# Altium project UE_Frequency_Converter.PrjPcb (part 1 of 2)
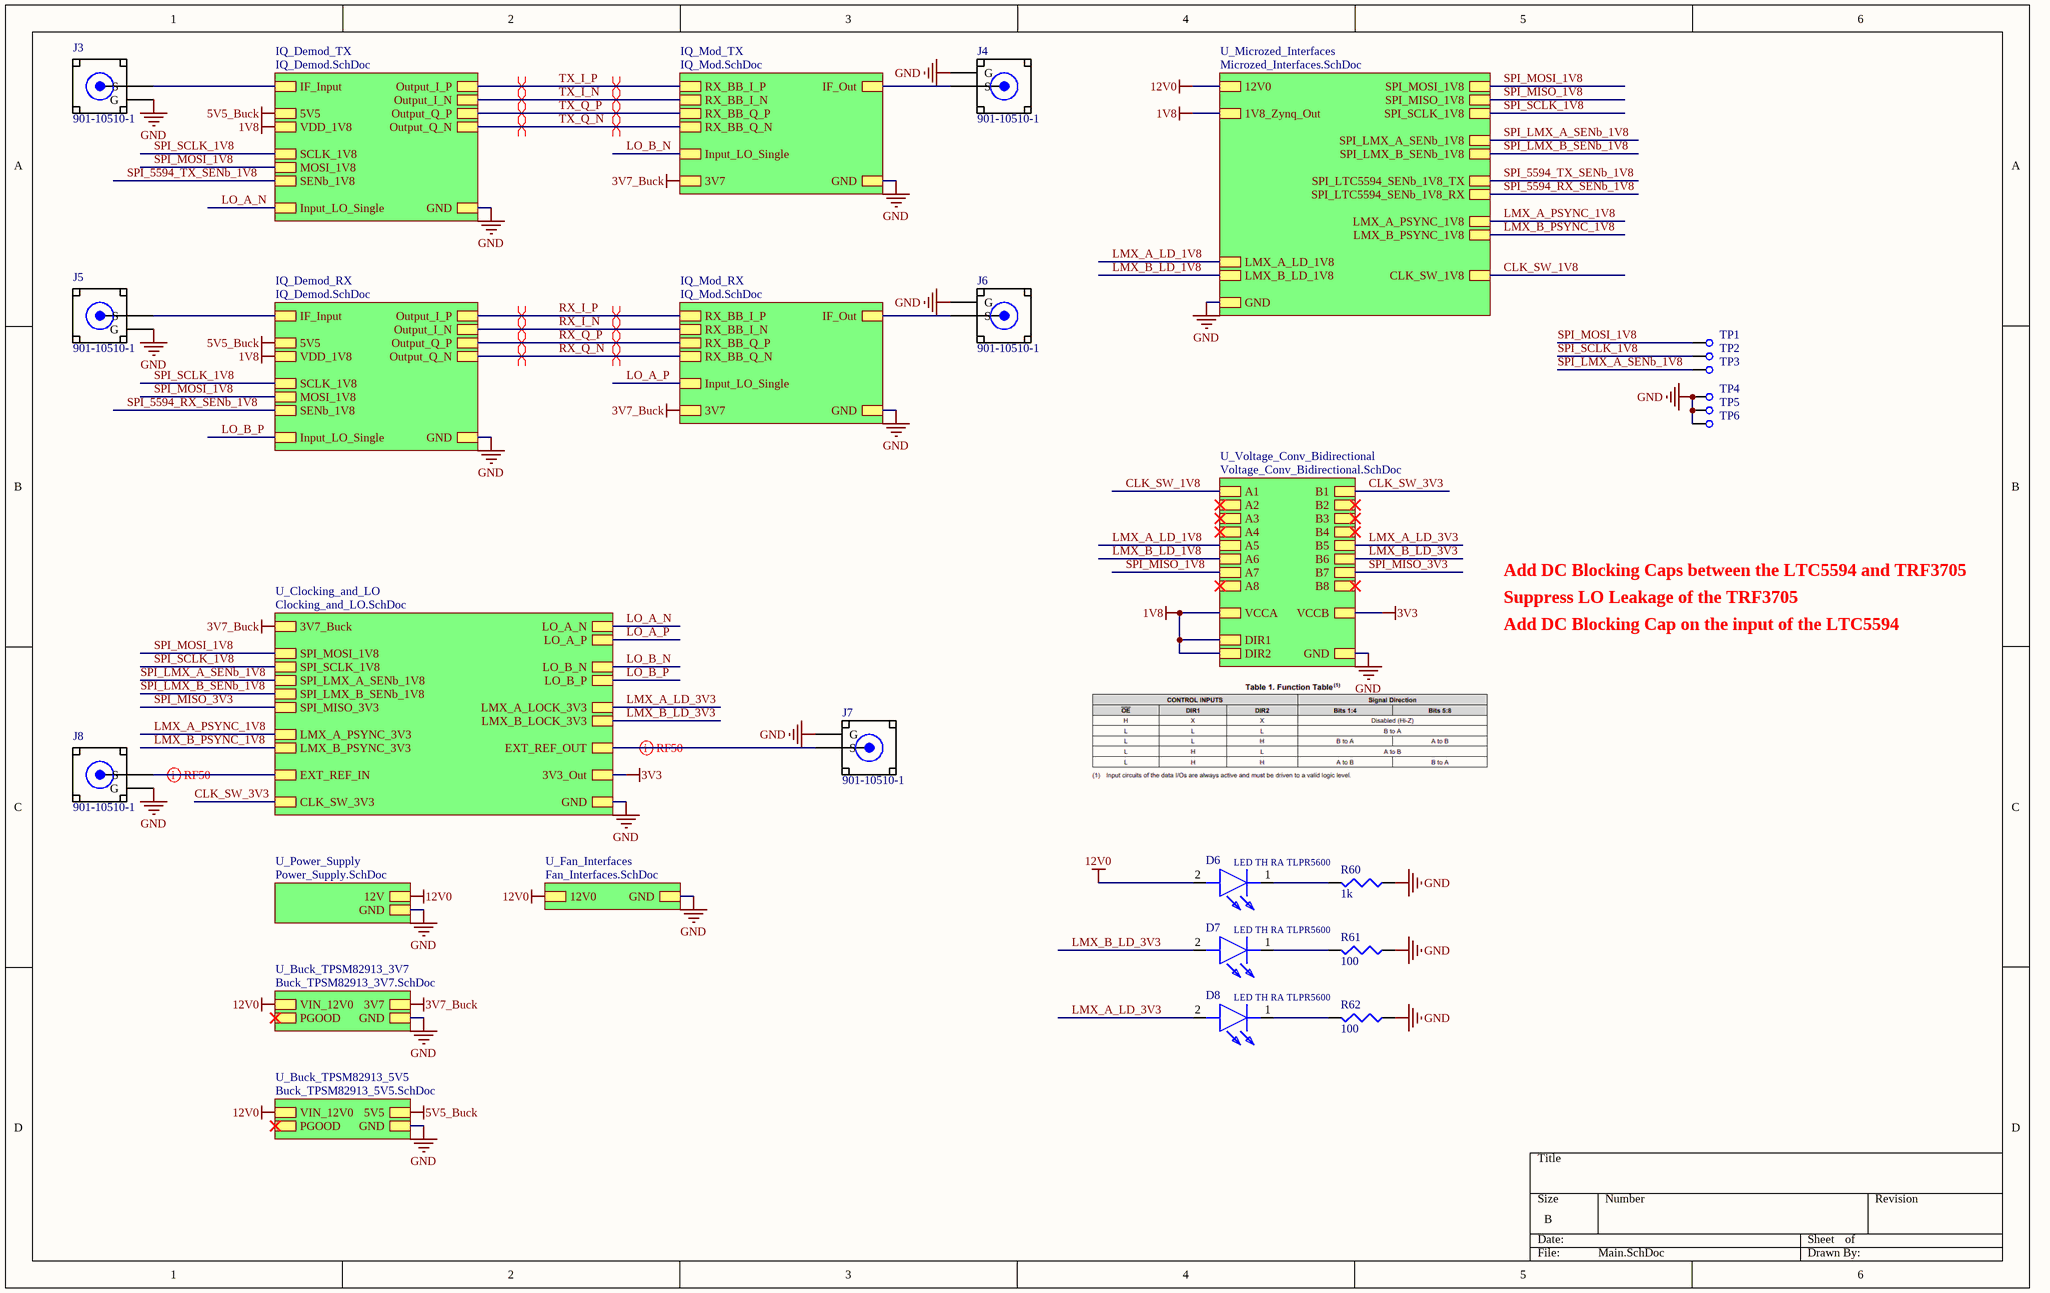
[diagram p0: Main.SchDoc]
15 sheets, 424 parts. Net scope: strictly hierarchical (ports join the sheet entries above them; power ports are local).
Board file: Main.PcbDoc
Sheets:
  Main.SchDoc
    IQ_Mod_TX = IQ_Mod.SchDoc
      U_3V7_to_3V3_LDO = 3V7_to_3V3_LDO.SchDoc
    IQ_Demod_TX = IQ_Demod.SchDoc
      U_5V5_to_5V0_LDO = 5V5_to_5V0_LDO.SchDoc
    IQ_Mod_RX = IQ_Mod.SchDoc
      U_3V7_to_3V3_LDO = 3V7_to_3V3_LDO.SchDoc
    IQ_Demod_RX = IQ_Demod.SchDoc
      U_5V5_to_5V0_LDO = 5V5_to_5V0_LDO.SchDoc
    U_Clocking_and_LO = Clocking_and_LO.SchDoc
      LMX2820_A = LMX2820.SchDoc
        U_3V7_to_3V3_LDO = 3V7_to_3V3_LDO.SchDoc
      LMX2820_B = LMX2820.SchDoc
        U_3V7_to_3V3_LDO = 3V7_to_3V3_LDO.SchDoc
      U_3V7_to_3V3_LDO_LMK = 3V7_to_3V3_LDO.SchDoc
      U_3V7_to_3V3_LDO_Crystal = 3V7_to_3V3_LDO.SchDoc
    U_Power_Supply = Power_Supply.SchDoc
    U_Microzed_Interfaces = Microzed_Interfaces.SchDoc
      U_Buck_TPSM82913_5V0 = Buck_TPSM82913_5V0.SchDoc
      U_Buck_TPSM82913_1V8 = Buck_TPSM82913_1V8.SchDoc
    U_Buck_TPSM82913_3V7 = Buck_TPSM82913_3V7.SchDoc
    U_Buck_TPSM82913_5V5 = Buck_TPSM82913_5V5.SchDoc
    U_Voltage_Conv_Bidirectional = Voltage_Conv_Bidirectional.SchDoc
    U_Fan_Interfaces = Fan_Interfaces.SchDoc

## Sheet Main.SchDoc
size B; SheetNumber: 1; SheetTotal: 15

### Parts
D6  LED TH RA TLPR5600  [LED TH RA TLPP5600]
D7  LED TH RA TLPR5600  [LED TH RA TLPP5600]
D8  LED TH RA TLPR5600  [LED TH RA TLPP5600]
J3  901-10510-1  [Amphenol RF 901-10510-1 - 8.8mil GCPW]
J4  901-10510-1  [Amphenol RF 901-10510-1 - 8.8mil GCPW]
J5  901-10510-1  [Amphenol RF 901-10510-1 - 8.8mil GCPW]
J6  901-10510-1  [Amphenol RF 901-10510-1 - 8.8mil GCPW]
J7  901-10510-1  [Amphenol RF 901-10510-1 - 8.8mil GCPW]
J8  901-10510-1  [Amphenol RF 901-10510-1 - 8.8mil GCPW]
R60  1k  [SMD-0402]
R61  100  [SMD-0402]
R62  100  [SMD-0402]
TP1  Keystone 5004  [Keystone 5004 Testpoint]  (value not drawn)
TP2  Keystone 5004  [Keystone 5004 Testpoint]  (value not drawn)
TP3  Keystone 5004  [Keystone 5004 Testpoint]  (value not drawn)
TP4  Keystone 5004  [Keystone 5004 Testpoint]  (value not drawn)
TP5  Keystone 5004  [Keystone 5004 Testpoint]  (value not drawn)
TP6  Keystone 5004  [Keystone 5004 Testpoint]  (value not drawn)

### Sub-sheets
IQ_Demod_RX = IQ_Demod.SchDoc: Input_LO_Single, GND, 5V5, VDD_1V8, IF_Input, SCLK_1V8, MOSI_1V8, SENb_1V8, Output_I_P, Output_I_N, Output_Q_N, Output_Q_P
IQ_Demod_TX = IQ_Demod.SchDoc: Input_LO_Single, GND, 5V5, VDD_1V8, IF_Input, SCLK_1V8, MOSI_1V8, SENb_1V8, Output_I_P, Output_I_N, Output_Q_N, Output_Q_P
IQ_Mod_RX = IQ_Mod.SchDoc: 3V7, GND, Input_LO_Single, RX_BB_I_N, RX_BB_I_P, RX_BB_Q_N, RX_BB_Q_P, IF_Out
IQ_Mod_TX = IQ_Mod.SchDoc: 3V7, GND, Input_LO_Single, RX_BB_I_N, RX_BB_I_P, RX_BB_Q_N, RX_BB_Q_P, IF_Out
U_Buck_TPSM82913_3V7 = Buck_TPSM82913_3V7.SchDoc: GND, VIN_12V0, PGOOD, 3V7
U_Buck_TPSM82913_5V5 = Buck_TPSM82913_5V5.SchDoc: GND, VIN_12V0, PGOOD, 5V5
U_Clocking_and_LO = Clocking_and_LO.SchDoc: 3V7_Buck, GND, SPI_MOSI_1V8, SPI_SCLK_1V8, SPI_LMX_A_SENb_1V8, SPI_MISO_3V3, SPI_LMX_B_SENb_1V8, LMX_B_PSYNC_3V3, LMX_A_LOCK_3V3, LMX_B_LOCK_3V3, LO_B_N, LO_B_P, EXT_REF_OUT, LMX_A_PSYNC_3V3, LO_A_N, LO_A_P, EXT_REF_IN, CLK_SW_3V3, 3V3_Out
U_Fan_Interfaces = Fan_Interfaces.SchDoc: 12V0, GND
U_Microzed_Interfaces = Microzed_Interfaces.SchDoc: 12V0, GND, CLK_SW_1V8, LMX_B_PSYNC_1V8, LMX_A_LD_1V8, LMX_B_LD_1V8, SPI_MISO_1V8, SPI_SCLK_1V8, SPI_MOSI_1V8, SPI_LMX_A_SENb_1V8, SPI_LMX_B_SENb_1V8, SPI_LTC5594_SENb_1V8_TX, SPI_LTC5594_SENb_1V8_RX, LMX_A_PSYNC_1V8, 1V8_Zynq_Out
U_Power_Supply = Power_Supply.SchDoc: 12V, GND
U_Voltage_Conv_Bidirectional = Voltage_Conv_Bidirectional.SchDoc: VCCA, VCCB, A1, DIR1, DIR2, A2, A3, A4, A5, A6, A7, A8, B1, B2, B3, B4, B5, B6, B7, B8, GND

### Nets
1V8: sheet IQ_Demod_TX/VDD_1V8, sheet IQ_Demod_RX/VDD_1V8, sheet U_Microzed_Interfaces/1V8_Zynq_Out, sheet U_Voltage_Conv_Bidirectional/VCCA, sheet U_Voltage_Conv_Bidirectional/DIR1, sheet U_Voltage_Conv_Bidirectional/DIR2
3V3: sheet U_Clocking_and_LO/3V3_Out, sheet U_Voltage_Conv_Bidirectional/VCCB
3V7_Buck: sheet IQ_Mod_TX/3V7, sheet IQ_Mod_RX/3V7, sheet U_Clocking_and_LO/3V7_Buck, sheet U_Buck_TPSM82913_3V7/3V7
5V5_Buck: sheet IQ_Demod_TX/5V5, sheet IQ_Demod_RX/5V5, sheet U_Buck_TPSM82913_5V5/5V5
12V0: D6.2(A) ; sheet U_Power_Supply/12V, sheet U_Microzed_Interfaces/12V0, sheet U_Buck_TPSM82913_3V7/VIN_12V0, sheet U_Buck_TPSM82913_5V5/VIN_12V0, sheet U_Fan_Interfaces/12V0
GND: J3.G J4.G J5.G J6.G J7.G J8.G R60.1 R61.1 R62.1 TP4.1 TP5.1 TP6.1 ; sheet IQ_Mod_TX/GND, sheet IQ_Demod_TX/GND, sheet IQ_Mod_RX/GND, sheet IQ_Demod_RX/GND, sheet U_Clocking_and_LO/GND, sheet U_Power_Supply/GND, sheet U_Microzed_Interfaces/GND, sheet U_Buck_TPSM82913_3V7/GND, sheet U_Buck_TPSM82913_5V5/GND, sheet U_Voltage_Conv_Bidirectional/GND, sheet U_Fan_Interfaces/GND
CLK_SW_1V8: sheet U_Microzed_Interfaces/CLK_SW_1V8, sheet U_Voltage_Conv_Bidirectional/A1
CLK_SW_3V3: sheet U_Clocking_and_LO/CLK_SW_3V3, sheet U_Voltage_Conv_Bidirectional/B1
LMX_A_LD_1V8: sheet U_Microzed_Interfaces/LMX_A_LD_1V8, sheet U_Voltage_Conv_Bidirectional/A5
LMX_A_LD_3V3: D8.2(A) ; sheet U_Clocking_and_LO/LMX_A_LOCK_3V3, sheet U_Voltage_Conv_Bidirectional/B5
LMX_A_PSYNC_1V8: sheet U_Clocking_and_LO/LMX_A_PSYNC_3V3, sheet U_Microzed_Interfaces/LMX_A_PSYNC_1V8
LMX_B_LD_1V8: sheet U_Microzed_Interfaces/LMX_B_LD_1V8, sheet U_Voltage_Conv_Bidirectional/A6
LMX_B_LD_3V3: D7.2(A) ; sheet U_Clocking_and_LO/LMX_B_LOCK_3V3, sheet U_Voltage_Conv_Bidirectional/B6
LMX_B_PSYNC_1V8: sheet U_Clocking_and_LO/LMX_B_PSYNC_3V3, sheet U_Microzed_Interfaces/LMX_B_PSYNC_1V8
LO_A_N: sheet IQ_Demod_TX/Input_LO_Single, sheet U_Clocking_and_LO/LO_A_N
LO_A_P: sheet IQ_Mod_RX/Input_LO_Single, sheet U_Clocking_and_LO/LO_A_P
LO_B_N: sheet IQ_Mod_TX/Input_LO_Single, sheet U_Clocking_and_LO/LO_B_N
LO_B_P: sheet IQ_Demod_RX/Input_LO_Single, sheet U_Clocking_and_LO/LO_B_P
RX_I_N: sheet IQ_Mod_RX/RX_BB_I_N, sheet IQ_Demod_RX/Output_I_N  [project net OP_QF_P]
RX_I_P: sheet IQ_Mod_RX/RX_BB_I_P, sheet IQ_Demod_RX/Output_I_P  [project net OP_QF_N]
RX_Q_N: sheet IQ_Mod_RX/RX_BB_Q_N, sheet IQ_Demod_RX/Output_Q_N  [project net OP_IF_N]
RX_Q_P: sheet IQ_Mod_RX/RX_BB_Q_P, sheet IQ_Demod_RX/Output_Q_P  [project net OP_IF_P]
SPI_5594_RX_SENb_1V8: sheet IQ_Demod_RX/SENb_1V8, sheet U_Microzed_Interfaces/SPI_LTC5594_SENb_1V8_RX
SPI_5594_TX_SENb_1V8: sheet IQ_Demod_TX/SENb_1V8, sheet U_Microzed_Interfaces/SPI_LTC5594_SENb_1V8_TX
SPI_LMX_A_SENb_1V8: TP3.1 ; sheet U_Clocking_and_LO/SPI_LMX_A_SENb_1V8, sheet U_Microzed_Interfaces/SPI_LMX_A_SENb_1V8
SPI_LMX_B_SENb_1V8: sheet U_Clocking_and_LO/SPI_LMX_B_SENb_1V8, sheet U_Microzed_Interfaces/SPI_LMX_B_SENb_1V8
SPI_MISO_1V8: sheet U_Microzed_Interfaces/SPI_MISO_1V8, sheet U_Voltage_Conv_Bidirectional/A7
SPI_MISO_3V3: sheet U_Clocking_and_LO/SPI_MISO_3V3, sheet U_Voltage_Conv_Bidirectional/B7
SPI_MOSI_1V8: TP1.1 ; sheet IQ_Demod_TX/MOSI_1V8, sheet IQ_Demod_RX/MOSI_1V8, sheet U_Clocking_and_LO/SPI_MOSI_1V8, sheet U_Microzed_Interfaces/SPI_MOSI_1V8
SPI_SCLK_1V8: TP2.1 ; sheet IQ_Demod_TX/SCLK_1V8, sheet IQ_Demod_RX/SCLK_1V8, sheet U_Clocking_and_LO/SPI_SCLK_1V8, sheet U_Microzed_Interfaces/SPI_SCLK_1V8
TX_I_N: sheet IQ_Mod_TX/RX_BB_I_N, sheet IQ_Demod_TX/Output_I_N  [project net OP_QF_P]
TX_I_P: sheet IQ_Mod_TX/RX_BB_I_P, sheet IQ_Demod_TX/Output_I_P  [project net OP_QF_N]
TX_Q_N: sheet IQ_Mod_TX/RX_BB_Q_N, sheet IQ_Demod_TX/Output_Q_N  [project net OP_IF_N]
TX_Q_P: sheet IQ_Mod_TX/RX_BB_Q_P, sheet IQ_Demod_TX/Output_Q_P  [project net OP_IF_P]
NetC9_1_2: J6.S ; sheet IQ_Mod_RX/IF_Out
NetC9_2_2: J4.S ; sheet IQ_Mod_TX/IF_Out
NetD6_1: D6.1(K) R60.2
NetD7_1: D7.1(K) R61.2
NetD8_1: D8.1(K) R62.2
NetJ3_S: J3.S ; sheet IQ_Demod_TX/IF_Input
NetJ5_S: J5.S ; sheet IQ_Demod_RX/IF_Input
NetJ7_S: J7.S ; sheet U_Clocking_and_LO/EXT_REF_OUT
NetJ8_S: J8.S ; sheet U_Clocking_and_LO/EXT_REF_IN

### Layout directives
differential pair: OP_IF_N, OP_IF_P, OP_QF_N, OP_QF_P
net class RF50: NetJ7_S, NetJ8_S
net class DIFF_100: OP_IF_N, OP_IF_P, OP_QF_N, OP_QF_P

### Notes on the sheet
- Add DC Blocking Caps between the LTC5594 and TRF3705
- Suppress LO Leakage of the TRF3705
- Add DC Blocking Cap on the input of the LTC5594

### Library data of the parts
D6-D8 = LED TH RA TLPR5600: LED Through Hole, Right Angle; Manufacturer_Name: Vishay; Datasheet Link: https://www.vishay.com/docs/83043/tlpg5600.pdf; Manufacturer_Part_Number: TLPR5600; Mouser Part Number: 78-TLPR5600; Mouser Price/Stock: https://www.mouser.co.uk/ProductDetail/Vishay-Semiconductors/TLPR5600?qs=RzxYCzJDjPV97gjcooV9KQ%3D%3D; Arrow Part Number: TLPR5600; Arrow Price/Stock: https://www.arrow.com/en/products/tlpr5600/vishay?region=nac
J3-J8 = Amphenol 901-10510-1: SMA Connector Jack, Female Socket 50 Ohms Board Edge, End Launch; Through Hole, Right Angle Solder (Square Flange); MF: Samtec; MP: SMA-J-P-H-ST-EM1; Price: None; SnapEDA_Link: https://www.snapeda.com/parts/SMA-J-P-H-ST-EM1/Samtec%20Inc./view-part/?ref=snap; Package: None; Availability: Unavailable; Value: *
R60-R62 = RES0402: Resistor-0402
TP1-TP6 = Keystone_TP_5000_Series: Test point 50mil diameter

## Sheet IQ_Mod.SchDoc
size B; SheetNumber: 2; SheetTotal: 15
Used 2 times, as channels IQ_Mod_TX, IQ_Mod_RX. Parts and nets are listed once, with the designators drawn on the sheet.
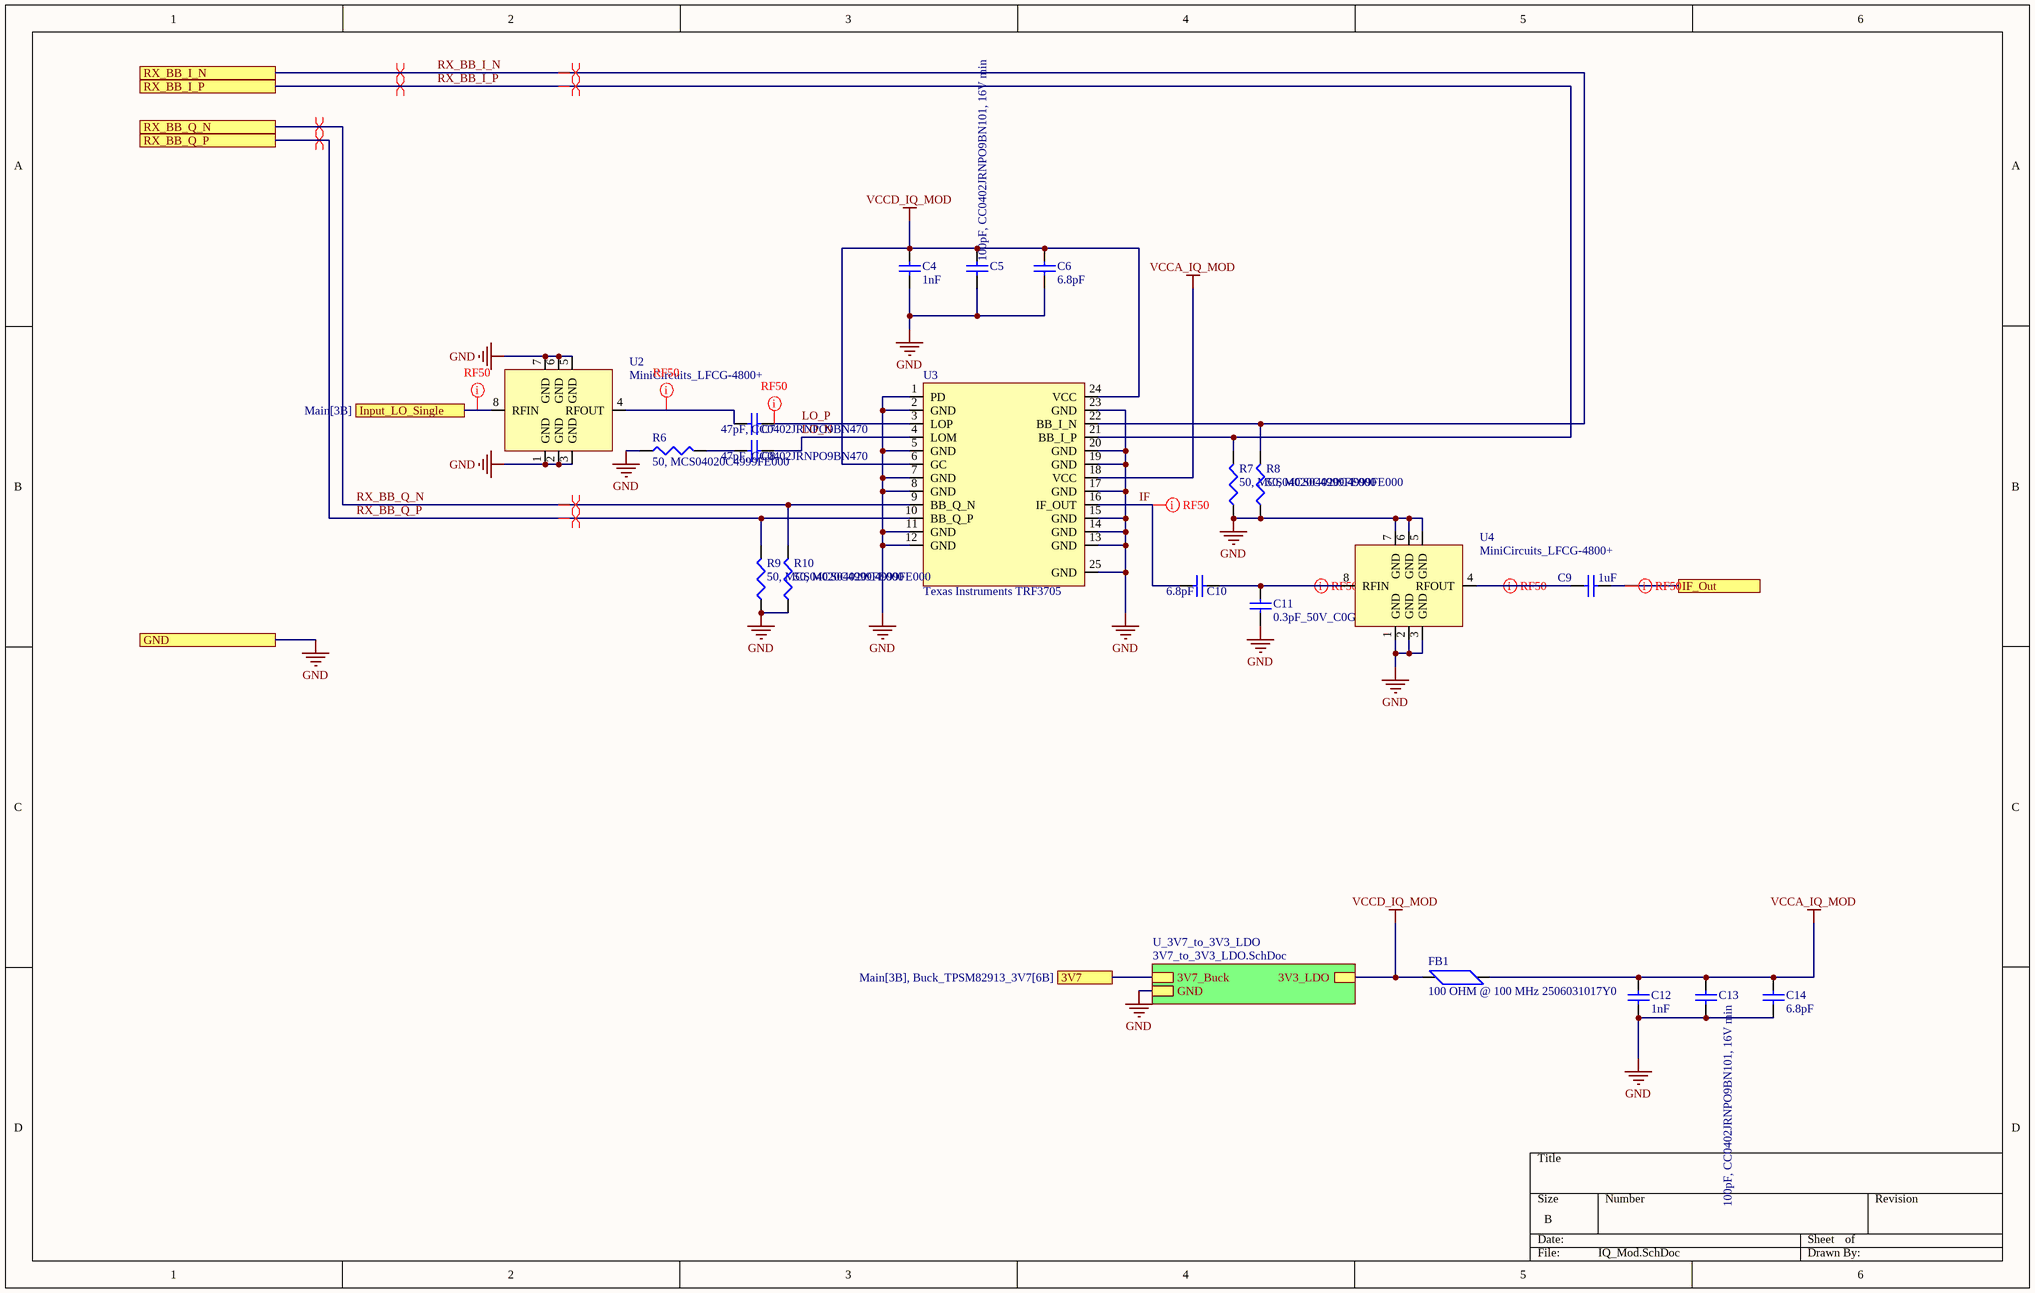
[diagram p1: IQ_Mod.SchDoc]

### Parts
C4  1nF  [SMD-0402]
C5  100pF, CC0402JRNPO9BN101, 16V min  [SMD-0402]
C6  6.8pF  [SMD-0402]
C7  47pF, CC0402JRNPO9BN470  [SMD-0402]
C8  47pF, CC0402JRNPO9BN470  [SMD-0402]
C9  1uF  [SMD-0402]
C10  6.8pF  [SMD-0402]
C11  0.3pF_50V_C0G  [SMD-0402]
C12  1nF  [SMD-0402]
C13  100pF, CC0402JRNPO9BN101, 16V min  [SMD-0402]
C14  6.8pF  [SMD-0402]
FB1  100 OHM @ 100 MHz 2506031017Y0  [SMD-0603]
R6  50, MCS04020C4999FE000  [SMD-0402]
R7  50, MCS04020C4999FE000  [SMD-0402]
R8  50, MCS04020C4999FE000  [SMD-0402]
R9  50, MCS04020C4999FE000  [SMD-0402]
R10  50, MCS04020C4999FE000  [SMD-0402]
U2  MiniCircuits_LFCG-4800+  [MiniCircuits LFCG-1400+]
U3  Texas Instruments TRF3705  [TI_RGE0024B]
U4  MiniCircuits_LFCG-4800+  [MiniCircuits LFCG-1400+]

### Sub-sheets
U_3V7_to_3V3_LDO = 3V7_to_3V3_LDO.SchDoc: 3V7_Buck, GND, 3V3_LDO

### Ports
3V7 (see Main[3B], Buck_TPSM82913_3V7[6B]), GND (see Main[3B], 3V7_to_3V3_LDO[1B], 5V5_to_5V0_LDO[1C], Buck_TPSM82913_1V8[3C], Buck_TPSM82913_3V7[3C], Buck_TPSM82913_5V0[3C], Buck_TPSM82913_5V5[2C], Clocking_and_LO[2A], Fan_Interfaces[2B], IQ_Demod[1C], LMX2820[4D], Microzed_Interfaces[1A], Power_Supply[6B], Voltage_Conv_Bidirectional[1B]), IF_Out (see Main[3A]), Input_LO_Single (see Main[3B]), RX_BB_I_N (see Main[3B]), RX_BB_I_P (see Main[3A]), RX_BB_Q_N (see Main[3B]), RX_BB_Q_P (see Main[3B])

### Nets
GND: C4.2 C5.2 C6.2 C11.2 C12.2 C13.2 C14.2 R6.1 R7.1 R8.1 R9.1 R10.1 U2.1(GND) U2.2(GND) U2.3(GND) U2.5(GND) U2.6(GND) U2.7(GND) U3.1(PD) U3.2(GND) U3.5(GND) U3.7(GND) U3.8(GND) U3.11(GND) U3.12(GND) U3.13(GND) U3.14(GND) U3.15(GND) U3.17(GND) U3.19(GND) U3.20(GND) U3.23(GND) U3.25(GND) U4.1(GND) U4.2(GND) U4.3(GND) U4.5(GND) U4.6(GND) U4.7(GND) ; port GND, sheet U_3V7_to_3V3_LDO/GND
VCCA_IQ_MOD: C12.1 C13.1 C14.1 FB1.1 U3.18(VCC)
VCCD_IQ_MOD: C4.1 C5.1 C6.1 FB1.2 U3.6(GC) U3.24(VCC) ; sheet U_3V7_to_3V3_LDO/3V3_LDO
3V7: port 3V7, sheet U_3V7_to_3V3_LDO/3V7_Buck
IF: C10.2 U3.16(IF_OUT)
IF_Out: C9.2 ; port IF_Out
Input_LO_Single: U2.8(RFIN) ; port Input_LO_Single
LO_N: C8.1 U3.4(LOM)
LO_P: C7.1 U3.3(LOP)
RX_BB_I_N: R8.2 U3.22(BB_I_N) ; port RX_BB_I_N
RX_BB_I_P: R7.2 U3.21(BB_I_P) ; port RX_BB_I_P
RX_BB_Q_N: R10.2 U3.9(BB_Q_N) ; port RX_BB_Q_N
RX_BB_Q_P: R9.2 U3.10(BB_Q_P) ; port RX_BB_Q_P
NetC7_2: C7.2 U2.4(RFOUT)
NetC8_2: C8.2 R6.2
NetC9_1: C9.1 U4.4(RFOUT)
NetC10_1: C10.1 C11.1 U4.8(RFIN)

### Channels
IQ_Mod_TX: designators end in _2; ports 3V7=3V7_Buck GND=GND IF_Out=NetC9_2_2 Input_LO_Single=LO_B_N RX_BB_I_N=OP_QF_P RX_BB_I_P=OP_QF_N RX_BB_Q_N=OP_IF_N RX_BB_Q_P=OP_IF_P
IQ_Mod_RX: designators end in _1; ports 3V7=3V7_Buck GND=GND IF_Out=NetC9_1_2 Input_LO_Single=LO_A_P RX_BB_I_N=OP_QF_P RX_BB_I_P=OP_QF_N RX_BB_Q_N=OP_IF_N RX_BB_Q_P=OP_IF_P

### Layout directives
net class RF50: IF_IQ_Mod_TX, LO_B_N, LO_P_IQ_Mod_TX, NetC7_2_2, NetC9_2_1, NetC9_2_2, NetC10_2_1
differential pair: OP_IF_N, OP_IF_P, OP_QF_N, OP_QF_P
net class DIFF_100: OP_IF_N, OP_IF_P, OP_QF_N, OP_QF_P

### Library data of the parts
C4-C14 = CAP0402: Ceramic Capacitor 0402
FB1 = FB0603: Ferrite Bead 0603
R6-R10 = RES0402: Resistor-0402
U2 U4 = MiniCircuits_LFCG-1400+

## Sheet 3V7_to_3V3_LDO.SchDoc
size A; SheetNumber: 3; SheetTotal: 15
Used 6 times, as channels IQ_Mod_TX/U_3V7_to_3V3_LDO, IQ_Mod_RX/U_3V7_to_3V3_LDO, U_Clocking_and_LO/LMX2820_A/U_3V7_to_3V3_LDO, U_Clocking_and_LO/LMX2820_B/U_3V7_to_3V3_LDO, U_Clocking_and_LO/U_3V7_to_3V3_LDO_LMK, U_Clocking_and_LO/U_3V7_to_3V3_LDO_Crystal. Parts and nets are listed once, with the designators drawn on the sheet.
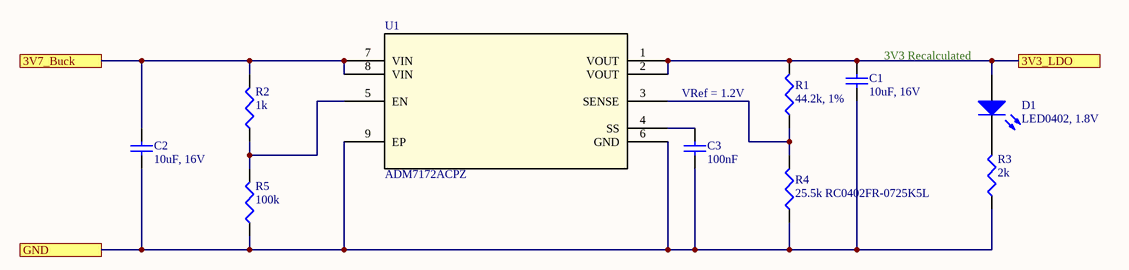
[diagram p2: 3V7_to_3V3_LDO.SchDoc]

### Parts
C1  10uF, 16V  [SMD-0603]
C2  10uF, 16V  [SMD-0603]
C3  100nF  [SMD-0402]
D1  LED0402, 1.8V  [LED-0402]
R1  44.2k, 1%  [SMD-0402]
R2  1k  [SMD-0402]
R3  2k  [SMD-0402]
R4  25.5k RC0402FR-0725K5L  [SMD-0402]
R5  100k  [SMD-0402]
U1  ADM7172ACPZ  [ADM7172_VIA_NOSILK]

### Ports
3V3_LDO (see IQ_Mod[5D]), 3V7_Buck (see IQ_Mod[4D], Clocking_and_LO[1B], LMX2820[3B]), GND (see IQ_Mod[4D], 5V5_to_5V0_LDO[1C], Buck_TPSM82913_1V8[3C], Buck_TPSM82913_3V7[3C], Buck_TPSM82913_5V0[3C], Buck_TPSM82913_5V5[2C], Clocking_and_LO[2A], Fan_Interfaces[2B], IQ_Demod[1C], IQ_Mod[1B], LMX2820[4D], Microzed_Interfaces[1A], Power_Supply[6B], Voltage_Conv_Bidirectional[1B])

### Nets
3V3_LDO: C1.2 D1.1(A) R1.2 U1.1(VOUT) U1.2(VOUT) ; port 3V3_LDO
3V7_Buck: C2.2 R2.2 U1.7(VIN) U1.8(VIN) ; port 3V7_Buck
GND: C1.1 C2.1 C3.1 R3.1 R4.1 R5.1 U1.6(GND) U1.9(EP) ; port GND
NetC3_2: C3.2 U1.4(SS)
NetD1_2: D1.2(K) R3.2
NetR1_1: R1.1 R4.2 U1.3(SENSE)
NetR2_1: R2.1 R5.2 U1.5(EN)

### Channels
IQ_Mod_TX/U_3V7_to_3V3_LDO: designators end in _2; ports 3V3_LDO=VCCD_IQ_MOD 3V7_Buck=3V7_Buck GND=GND
IQ_Mod_RX/U_3V7_to_3V3_LDO: designators end in _1; ports 3V3_LDO=VCCD_IQ_MOD 3V7_Buck=3V7_Buck GND=GND
U_Clocking_and_LO/LMX2820_A/U_3V7_to_3V3_LDO: designators end in _3; ports 3V3_LDO=3V3_LDO_LMX 3V7_Buck=3V7_Buck GND=GND
U_Clocking_and_LO/LMX2820_B/U_3V7_to_3V3_LDO: designators end in _4; ports 3V3_LDO=3V3_LDO_LMX 3V7_Buck=3V7_Buck GND=GND
U_Clocking_and_LO/U_3V7_to_3V3_LDO_LMK: designators end in _6; ports 3V3_LDO=3V3 3V7_Buck=3V7_Buck GND=GND
U_Clocking_and_LO/U_3V7_to_3V3_LDO_Crystal: designators end in _5; ports 3V3_LDO=3V3_LDO_Crystal 3V7_Buck=3V7_Buck GND=GND

### Notes on the sheet
- 3V3 Recalculated
- VRef = 1.2V

### Library data of the parts
C1 C2 = CAP0603: Ceramic Capacitor 0603
C3 = CAP0402: Ceramic Capacitor 0402
D1 = LED0402: LED 0402
R1-R5 = RES0402: Resistor-0402
U1 = ADM7172ACPZ: 6.5V, 2A, Ultralow Noise, High PSRR, Fast Transient Response CMOS LDO; Value: Value; Type: Type; RefDes: RefDes

## Sheet IQ_Demod.SchDoc
size B; SheetNumber: 4; SheetTotal: 15
Used 2 times, as channels IQ_Demod_TX, IQ_Demod_RX. Parts and nets are listed once, with the designators drawn on the sheet.
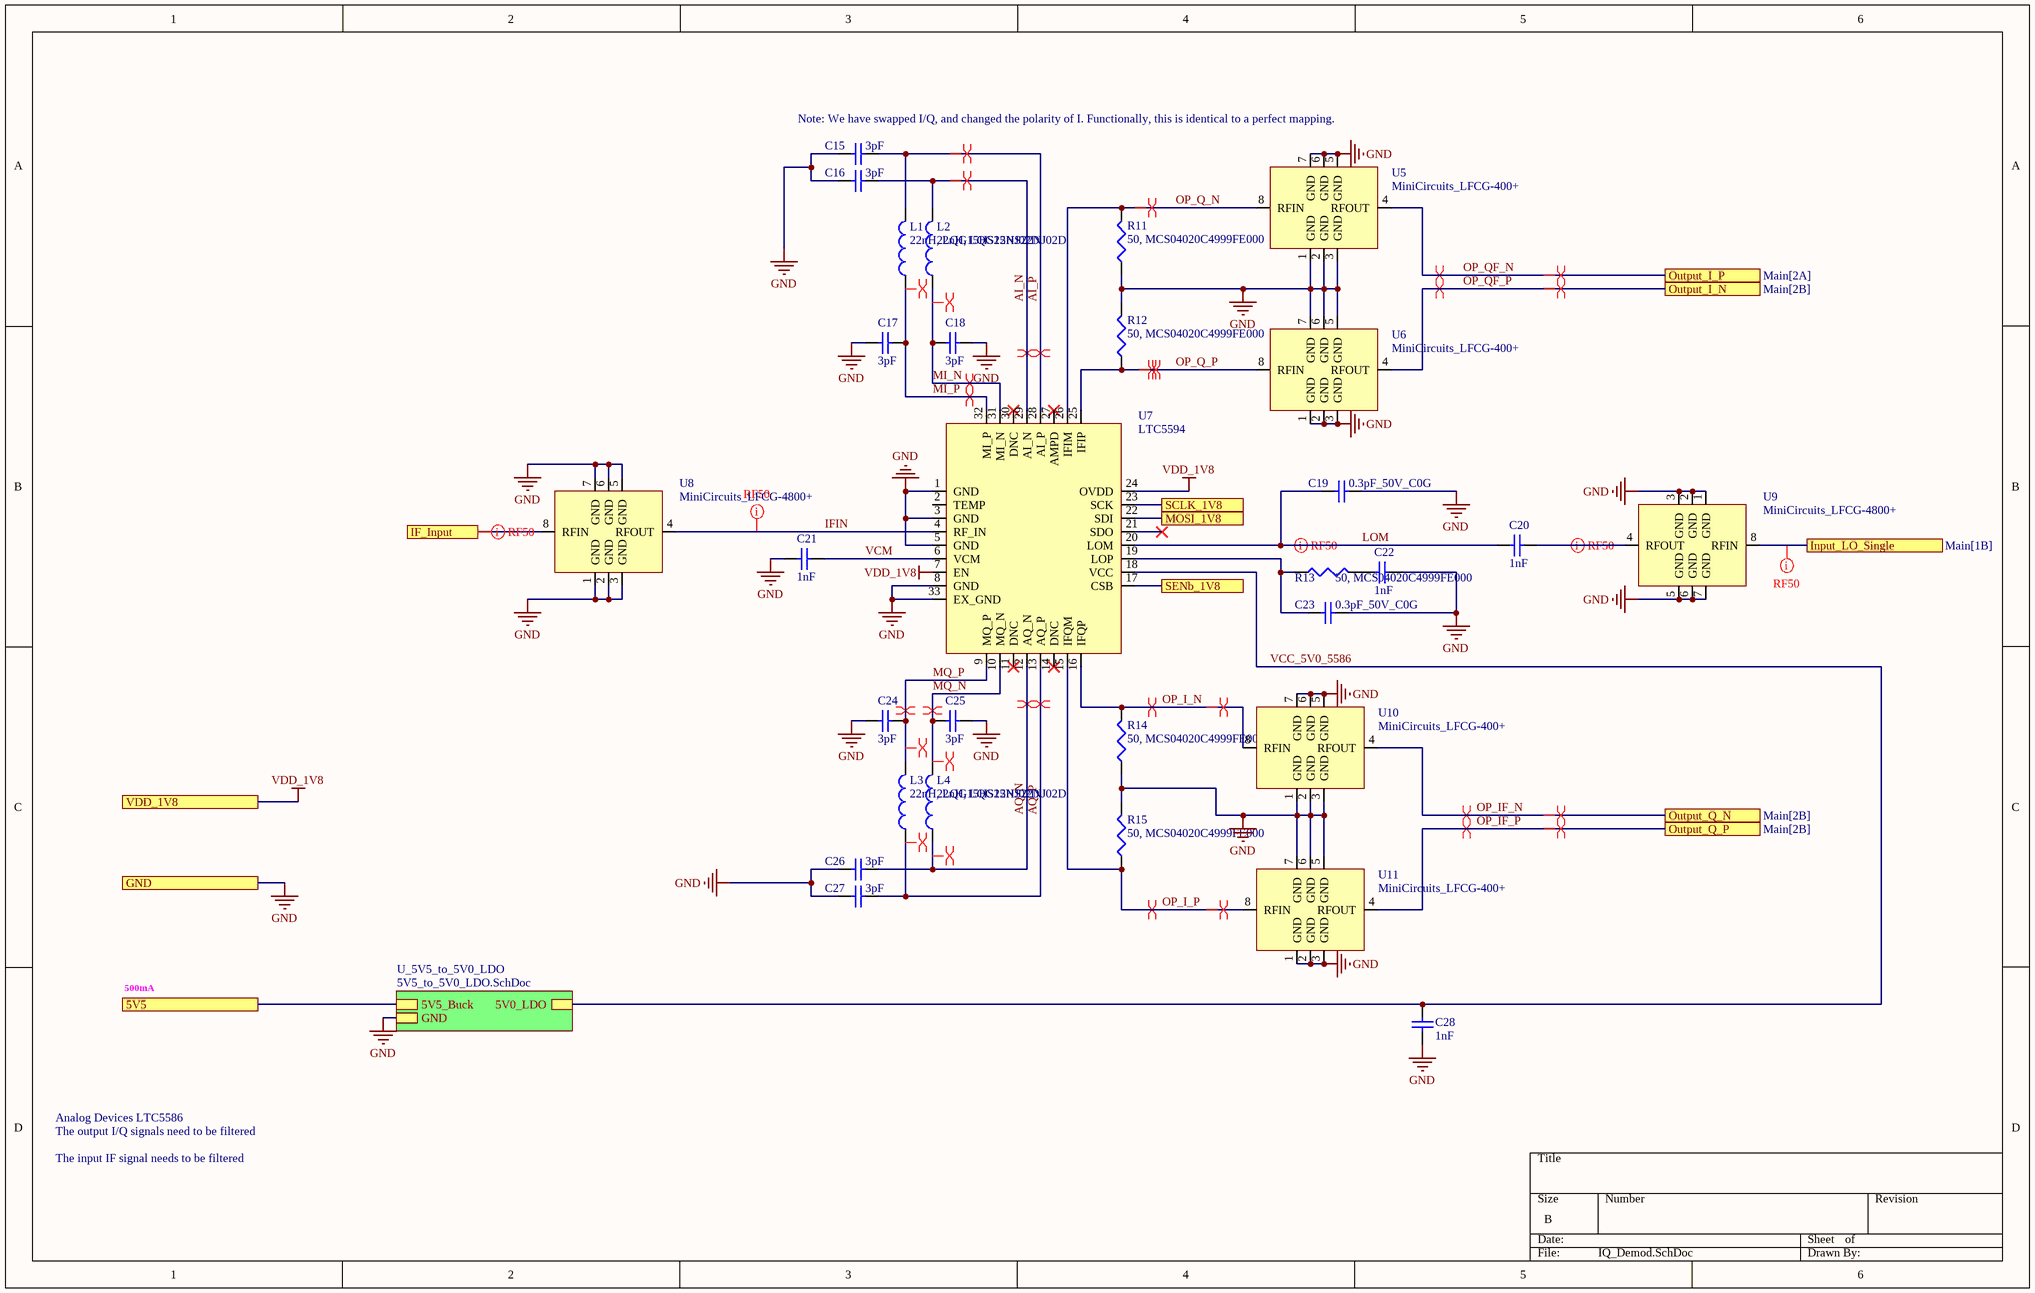
[diagram p3: IQ_Demod.SchDoc]

### Parts
C15  3pF  [Johanson-0201]
C16  3pF  [Johanson-0201]
C17  3pF  [Johanson-0201]
C18  3pF  [Johanson-0201]
C19  0.3pF_50V_C0G  [SMD-0402]
C20  1nF  [SMD-0402]
C21  1nF  [SMD-0402]
C22  1nF  [SMD-0402]
C23  0.3pF_50V_C0G  [SMD-0402]
C24  3pF  [Johanson-0201]
C25  3pF  [Johanson-0201]
C26  3pF  [Johanson-0201]
C27  3pF  [Johanson-0201]
C28  1nF  [SMD-0402]
L1  22nH, LQG15HS22NJ02D  [SMD-0402]
L2  22nH, LQG15HS22NJ02D  [SMD-0402]
L3  22nH, LQG15HS22NJ02D  [SMD-0402]
L4  22nH, LQG15HS22NJ02D  [SMD-0402]
R11  50, MCS04020C4999FE000  [SMD-0402]
R12  50, MCS04020C4999FE000  [SMD-0402]
R13  50, MCS04020C4999FE000  [SMD-0402]
R14  50, MCS04020C4999FE000  [SMD-0402]
R15  50, MCS04020C4999FE000  [SMD-0402]
U5  MiniCircuits_LFCG-400+  [MiniCircuits LFCG-1400+]
U6  MiniCircuits_LFCG-400+  [MiniCircuits LFCG-1400+]
U7  LTC5594  [LTC5594]
U8  MiniCircuits_LFCG-4800+  [MiniCircuits LFCG-1400+]
U9  MiniCircuits_LFCG-4800+  [MiniCircuits LFCG-1400+]
U10  MiniCircuits_LFCG-400+  [MiniCircuits LFCG-1400+]
U11  MiniCircuits_LFCG-400+  [MiniCircuits LFCG-1400+]

### Sub-sheets
U_5V5_to_5V0_LDO = 5V5_to_5V0_LDO.SchDoc: 5V5_Buck, GND, 5V0_LDO

### Ports
5V5 (see Main[1B], Buck_TPSM82913_5V5[5B]), GND (see Main[2B], 3V7_to_3V3_LDO[1B], 5V5_to_5V0_LDO[1C], Buck_TPSM82913_1V8[3C], Buck_TPSM82913_3V7[3C], Buck_TPSM82913_5V0[3C], Buck_TPSM82913_5V5[2C], Clocking_and_LO[2A], Fan_Interfaces[2B], IQ_Mod[1B], LMX2820[4D], Microzed_Interfaces[1A], Power_Supply[6B], Voltage_Conv_Bidirectional[1B]), IF_Input (see Main[1A]), Input_LO_Single (see Main[1B]), MOSI_1V8 (see Main[1B]), Output_I_N (see Main[2B]), Output_I_P (see Main[2A]), Output_Q_N (see Main[2B]), Output_Q_P (see Main[2B]), SCLK_1V8 (see Main[1B]), SENb_1V8 (see Main[1B]), VDD_1V8 (see Main[1B])

### Nets
GND: C15.1 C16.1 C17.1 C18.2 C19.2 C21.2 C22.1 C23.2 C24.1 C25.2 C26.1 C27.1 C28.2 R11.1 R12.2 R14.1 R15.2 U5.1(GND) U5.2(GND) U5.3(GND) U5.5(GND) U5.6(GND) U5.7(GND) U6.1(GND) U6.2(GND) U6.3(GND) U6.5(GND) U6.6(GND) U6.7(GND) U7.1(GND) U7.3(GND) U7.5(GND) U7.8(GND) U7.33(EX_GND) U8.1(GND) U8.2(GND) U8.3(GND) U8.5(GND) U8.6(GND) U8.7(GND) U9.1(GND) U9.2(GND) U9.3(GND) U9.5(GND) U9.6(GND) U9.7(GND) U10.1(GND) U10.2(GND) U10.3(GND) U10.5(GND) U10.6(GND) U10.7(GND) U11.1(GND) U11.2(GND) U11.3(GND) U11.5(GND) U11.6(GND) U11.7(GND) ; port GND, sheet U_5V5_to_5V0_LDO/GND
VDD_1V8: U7.7(EN) U7.24(OVDD) ; port VDD_1V8
5V5: port 5V5, sheet U_5V5_to_5V0_LDO/5V5_Buck
AI_N: C16.2 L2.2 U7.29(AI_N)
AI_P: C15.2 L1.2 U7.28(AI_P)
AQ_N: C26.2 L4.1 U7.12(AQ_N)
AQ_P: C27.2 L3.1 U7.13(AQ_P)
IF_Input: U8.8(RFIN) ; port IF_Input
IFIN: U7.4(RF_IN) U8.4(RFOUT)
Input_LO_Single: U9.8(RFIN) ; port Input_LO_Single
LOM: C19.1 C20.2 U7.20(LOM)
MI_N: C18.1 L2.1 U7.31(MI_N)
MI_P: C17.2 L1.1 U7.32(MI_P)
MOSI_1V8: U7.22(SDI) ; port MOSI_1V8
MQ_N: C25.1 L4.2 U7.10(MQ_N)
MQ_P: C24.2 L3.2 U7.9(MQ_P)
OP_I_N: R14.2 U7.16(IFQP) U10.8(RFIN)
OP_I_P: R15.1 U7.15(IFQM) U11.8(RFIN)
OP_IF_N: U10.4(RFOUT) ; port Output_Q_N
OP_IF_P: U11.4(RFOUT) ; port Output_Q_P
OP_Q_N: R11.2 U5.8(RFIN) U7.26(IFIM)
OP_Q_P: R12.1 U6.8(RFIN) U7.25(IFIP)
OP_QF_N: U5.4(RFOUT) ; port Output_I_P
OP_QF_P: U6.4(RFOUT) ; port Output_I_N
SCLK_1V8: U7.23(SCK) ; port SCLK_1V8
SENb_1V8: U7.17(CSB) ; port SENb_1V8
VCC_5V0_5586: C28.1 U7.18(VCC) ; sheet U_5V5_to_5V0_LDO/5V0_LDO
VCM: C21.1 U7.6(VCM)
NetC20_1: C20.1 U9.4(RFOUT)
NetC22_2: C22.2 R13.2
NetC23_1: C23.1 R13.1 U7.19(LOP)

Not connected (* = marked no-connect by the designer): U7 2(TEMP) 11(DNC)* 14(DNC)* 21(SDO)* 27(AMPD)* 30(DNC)*

### Channels
IQ_Demod_TX: designators end in _2; ports 5V5=5V5_Buck GND=GND IF_Input=NetJ3_S Input_LO_Single=LO_A_N MOSI_1V8=SPI_MOSI_1V8 Output_I_N=OP_QF_P Output_I_P=OP_QF_N Output_Q_N=OP_IF_N Output_Q_P=OP_IF_P SCLK_1V8=SPI_SCLK_1V8 SENb_1V8=SPI_5594_TX_SENb_1V8 VDD_1V8=1V8
IQ_Demod_RX: designators end in _1; ports 5V5=5V5_Buck GND=GND IF_Input=NetJ5_S Input_LO_Single=LO_B_P MOSI_1V8=SPI_MOSI_1V8 Output_I_N=OP_QF_P Output_I_P=OP_QF_N Output_Q_N=OP_IF_N Output_Q_P=OP_IF_P SCLK_1V8=SPI_SCLK_1V8 SENb_1V8=SPI_5594_RX_SENb_1V8 VDD_1V8=1V8

### Layout directives
net class RF50: IFIN_IQ_Demod_TX, LO_A_N, LOM_IQ_Demod_TX, NetC20_2_1, NetJ3_S
differential pair: AI_N_IQ_Demod_TX, AI_P_IQ_Demod_TX, AQ_N_IQ_Demod_TX, AQ_P_IQ_Demod_TX, MI_N_IQ_Demod_TX, MI_P_IQ_Demod_TX, MQ_N_IQ_Demod_TX, MQ_P_IQ_Demod_TX
differential pair; differential pair class DEMOD_OUT: OP_I_N_IQ_Demod_TX, OP_I_P_IQ_Demod_TX, OP_IF_N, OP_IF_P, OP_Q_N_IQ_Demod_TX, OP_Q_P_IQ_Demod_TX, OP_QF_N, OP_QF_P
net class DIFF_100: AI_N_IQ_Demod_TX, AI_P_IQ_Demod_TX, AQ_N_IQ_Demod_TX, AQ_P_IQ_Demod_TX, MI_N_IQ_Demod_TX, MI_P_IQ_Demod_TX, MQ_N_IQ_Demod_TX, MQ_P_IQ_Demod_TX, OP_I_N_IQ_Demod_TX, OP_I_P_IQ_Demod_TX, OP_IF_N, OP_IF_P, OP_Q_N_IQ_Demod_TX, OP_Q_P_IQ_Demod_TX, OP_QF_N, OP_QF_P

### Notes on the sheet
- Note: We have swapped I/Q, and changed the polarity of I. Functionally, this is identical to a perfect mapping.
- 500mA
- Analog Devices LTC5586
- The output I/Q signals need to be filtered
- The input IF signal needs to be filtered

### Library data of the parts
C15-C18 C24-C27 = CAP0201: Capacitor 0201 Imperial
C19-C23 C28 = CAP0402: Ceramic Capacitor 0402
L1-L4 = L0402: Inductor 0402
R11-R15 = RES0402: Resistor-0402
U5 U6 U10 U11 = MiniCircuits_LFCG-400+: DC-530MHz LPF
U8 U9 = MiniCircuits_LFCG-1400+

## Sheet 5V5_to_5V0_LDO.SchDoc
size A; SheetNumber: 5; SheetTotal: 15
Used 2 times, as channels IQ_Demod_TX/U_5V5_to_5V0_LDO, IQ_Demod_RX/U_5V5_to_5V0_LDO. Parts and nets are listed once, with the designators drawn on the sheet.
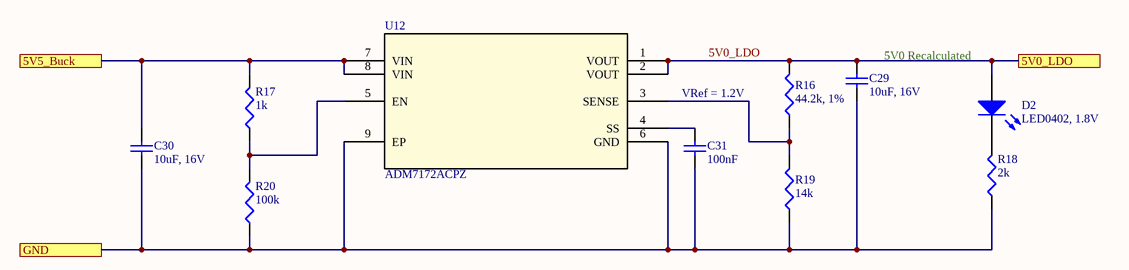
[diagram p4: 5V5_to_5V0_LDO.SchDoc]

### Parts
C29  10uF, 16V  [SMD-0603]
C30  10uF, 16V  [SMD-0603]
C31  100nF  [SMD-0402]
D2  LED0402, 1.8V  [LED-0402]
R16  44.2k, 1%  [SMD-0402]
R17  1k  [SMD-0402]
R18  2k  [SMD-0402]
R19  14k  [SMD-0402]
R20  100k  [SMD-0402]
U12  ADM7172ACPZ  [ADM7172_VIA_NOSILK]

### Ports
5V0_LDO (see IQ_Demod[2D]), 5V5_Buck (see IQ_Demod[2D]), GND (see IQ_Demod[2D], 3V7_to_3V3_LDO[1B], Buck_TPSM82913_1V8[3C], Buck_TPSM82913_3V7[3C], Buck_TPSM82913_5V0[3C], Buck_TPSM82913_5V5[2C], Clocking_and_LO[2A], Fan_Interfaces[2B], IQ_Demod[1C], IQ_Mod[1B], LMX2820[4D], Microzed_Interfaces[1A], Power_Supply[6B], Voltage_Conv_Bidirectional[1B])

### Nets
5V0_LDO: C29.2 D2.1(A) R16.2 U12.1(VOUT) U12.2(VOUT) ; port 5V0_LDO
5V5_Buck: C30.2 R17.2 U12.7(VIN) U12.8(VIN) ; port 5V5_Buck
GND: C29.1 C30.1 C31.1 R18.1 R19.1 R20.1 U12.6(GND) U12.9(EP) ; port GND
NetC31_2: C31.2 U12.4(SS)
NetD2_2: D2.2(K) R18.2
NetR16_1: R16.1 R19.2 U12.3(SENSE)
NetR17_1: R17.1 R20.2 U12.5(EN)

### Channels
IQ_Demod_TX/U_5V5_to_5V0_LDO: designators end in _2; ports 5V0_LDO=5V0_LDO 5V5_Buck=5V5_Buck GND=GND
IQ_Demod_RX/U_5V5_to_5V0_LDO: designators end in _1; ports 5V0_LDO=5V0_LDO 5V5_Buck=5V5_Buck GND=GND

### Notes on the sheet
- 5V0 Recalculated
- VRef = 1.2V

### Library data of the parts
C29 C30 = CAP0603: Ceramic Capacitor 0603
C31 = CAP0402: Ceramic Capacitor 0402
D2 = LED0402: LED 0402
R16-R20 = RES0402: Resistor-0402
U12 = ADM7172ACPZ: as U1 on sheet 3V7_to_3V3_LDO; Value: Value; Type: Type; RefDes: RefDes

## Sheet Clocking_and_LO.SchDoc
size C; SheetNumber: 6; SheetTotal: 15
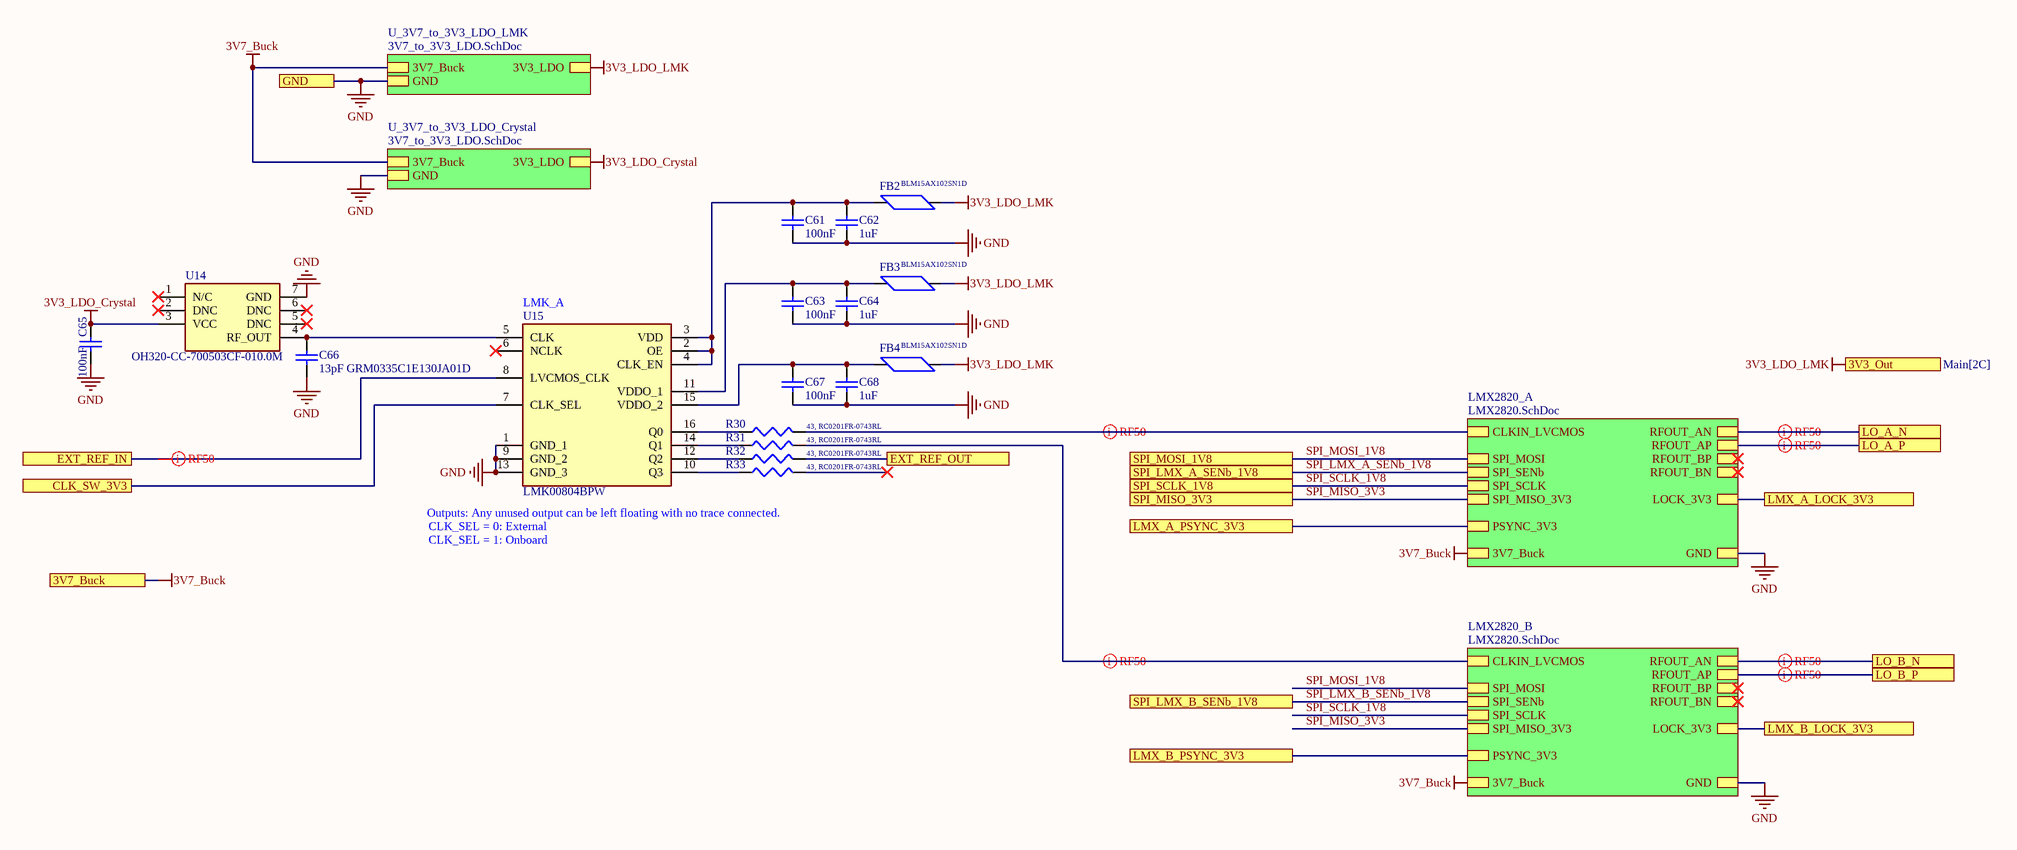
[diagram p5: Clocking_and_LO.SchDoc]

### Parts
C61  100nF  [SMD-0402]
C62  1uF  [SMD-0402]
C63  100nF  [SMD-0402]
C64  1uF  [SMD-0402]
C65  100nF  [SMD-0402]
C66  13pF GRM0335C1E130JA01D  [Johanson-0201]
C67  100nF  [SMD-0402]
C68  1uF  [SMD-0402]
FB2  BLM15AX102SN1D  [SMD-0402]
FB3  BLM15AX102SN1D  [SMD-0402]
FB4  BLM15AX102SN1D  [SMD-0402]
R30  43, RC0201FR-0743RL  [Johanson-0201]
R31  43, RC0201FR-0743RL  [Johanson-0201]
R32  43, RC0201FR-0743RL  [Johanson-0201]
R33  43, RC0201FR-0743RL  [Johanson-0201]
U14  OH320-CC-700503CF-010.0M  [OH320-CC-700503CF-010.0M]
U15  LMK00804BPW  [LMK00804]

### Sub-sheets
LMX2820_A = LMX2820.SchDoc: RFOUT_AP, GND, SPI_MOSI, SPI_SENb, SPI_SCLK, 3V7_Buck, RFOUT_AN, RFOUT_BN, RFOUT_BP, CLKIN_LVCMOS, SPI_MISO_3V3, LOCK_3V3, PSYNC_3V3
LMX2820_B = LMX2820.SchDoc: RFOUT_AP, GND, SPI_MOSI, SPI_SENb, SPI_SCLK, 3V7_Buck, RFOUT_AN, RFOUT_BN, RFOUT_BP, CLKIN_LVCMOS, SPI_MISO_3V3, LOCK_3V3, PSYNC_3V3
U_3V7_to_3V3_LDO_Crystal = 3V7_to_3V3_LDO.SchDoc: 3V7_Buck, GND, 3V3_LDO
U_3V7_to_3V3_LDO_LMK = 3V7_to_3V3_LDO.SchDoc: 3V7_Buck, GND, 3V3_LDO

### Ports
3V3_Out (see Main[2C]), 3V7_Buck (see Main[1B], 3V7_to_3V3_LDO[1A], LMX2820[3B]), CLK_SW_3V3 (see Main[1C]), EXT_REF_IN (see Main[1C]), EXT_REF_OUT (see Main[2C]), GND (see Main[2C], 3V7_to_3V3_LDO[1B], 5V5_to_5V0_LDO[1C], Buck_TPSM82913_1V8[3C], Buck_TPSM82913_3V7[3C], Buck_TPSM82913_5V0[3C], Buck_TPSM82913_5V5[2C], Fan_Interfaces[2B], IQ_Demod[1C], IQ_Mod[1B], LMX2820[4D], Microzed_Interfaces[1A], Power_Supply[6B], Voltage_Conv_Bidirectional[1B]), LMX_A_LOCK_3V3 (see Main[2C]), LMX_A_PSYNC_3V3 (see Main[1C]), LMX_B_LOCK_3V3 (see Main[2C]), LMX_B_PSYNC_3V3 (see Main[1C]), LO_A_N (see Main[2B]), LO_A_P (see Main[2B]), LO_B_N (see Main[2C]), LO_B_P (see Main[2C]), SPI_LMX_A_SENb_1V8 (see Main[1C], Microzed_Interfaces[4B]), SPI_LMX_B_SENb_1V8 (see Main[1C], Microzed_Interfaces[4A]), SPI_MISO_3V3 (see Main[1C], LMX2820[5B]), SPI_MOSI_1V8 (see Main[1C], Microzed_Interfaces[4D]), SPI_SCLK_1V8 (see Main[1C], Microzed_Interfaces[4D])

### Nets
3V3_LDO_Crystal: C65.2 U14.3(VCC) ; sheet U_3V7_to_3V3_LDO_Crystal/3V3_LDO
3V3_LDO_LMK: FB2.1 FB3.1 FB4.1 ; port 3V3_Out, sheet U_3V7_to_3V3_LDO_LMK/3V3_LDO  [project net 3V3]
3V7_Buck: port 3V7_Buck, sheet LMX2820_A/3V7_Buck, sheet LMX2820_B/3V7_Buck, sheet U_3V7_to_3V3_LDO_LMK/3V7_Buck, sheet U_3V7_to_3V3_LDO_Crystal/3V7_Buck
GND: C61.2 C62.2 C63.2 C64.2 C65.1 C66.1 C67.2 C68.2 U14.7(GND) U15.1(GND_1) U15.9(GND_2) U15.13(GND_3) ; port GND, sheet LMX2820_A/GND, sheet LMX2820_B/GND, sheet U_3V7_to_3V3_LDO_LMK/GND, sheet U_3V7_to_3V3_LDO_Crystal/GND
CLK_SW_3V3: U15.7(CLK_SEL) ; port CLK_SW_3V3
LMX_A_LD_3V3: port LMX_A_LOCK_3V3, sheet LMX2820_A/LOCK_3V3
LMX_A_PSYNC_1V8: port LMX_A_PSYNC_3V3, sheet LMX2820_A/PSYNC_3V3
LMX_B_LD_3V3: port LMX_B_LOCK_3V3, sheet LMX2820_B/LOCK_3V3
LMX_B_PSYNC_1V8: port LMX_B_PSYNC_3V3, sheet LMX2820_B/PSYNC_3V3
LO_A_N: port LO_A_N, sheet LMX2820_A/RFOUT_AN
LO_A_P: port LO_A_P, sheet LMX2820_A/RFOUT_AP
LO_B_N: port LO_B_N, sheet LMX2820_B/RFOUT_AN
LO_B_P: port LO_B_P, sheet LMX2820_B/RFOUT_AP
SPI_LMX_A_SENb_1V8: port SPI_LMX_A_SENb_1V8, sheet LMX2820_A/SPI_SENb
SPI_LMX_B_SENb_1V8: port SPI_LMX_B_SENb_1V8, sheet LMX2820_B/SPI_SENb
SPI_MISO_3V3: port SPI_MISO_3V3, sheet LMX2820_A/SPI_MISO_3V3, sheet LMX2820_B/SPI_MISO_3V3
SPI_MOSI_1V8: port SPI_MOSI_1V8, sheet LMX2820_A/SPI_MOSI, sheet LMX2820_B/SPI_MOSI
SPI_SCLK_1V8: port SPI_SCLK_1V8, sheet LMX2820_A/SPI_SCLK, sheet LMX2820_B/SPI_SCLK
NetC58_1_2: R30.2 ; sheet LMX2820_A/CLKIN_LVCMOS
NetC58_2_2: R31.2 ; sheet LMX2820_B/CLKIN_LVCMOS
NetC61_1: C61.1 C62.1 FB2.2 U15.2(OE) U15.3(VDD) U15.4(CLK_EN)
NetC63_1: C63.1 C64.1 FB3.2 U15.11(VDDO_1)
NetC66_2: C66.2 U14.4(RF_OUT) U15.5(CLK)
NetC67_1: C67.1 C68.1 FB4.2 U15.15(VDDO_2)
NetJ7_S: R32.2 ; port EXT_REF_OUT
NetJ8_S: U15.8(LVCMOS_CLK) ; port EXT_REF_IN
NetR30_1: R30.1 U15.16(Q0)
NetR31_1: R31.1 U15.14(Q1)
NetR32_1: R32.1 U15.12(Q2)
NetR33_1: R33.1 U15.10(Q3)

Not connected (* = marked no-connect by the designer): R33 2*; U14 1(N/C)* 2(DNC)* 5(DNC)* 6(DNC)*; U15 6(NCLK)*

### Layout directives
net class RF50: LO_A_N, LO_A_P, LO_B_N, LO_B_P, NetC58_1_2, NetC58_2_2, NetJ8_S

### Notes on the sheet
- (near U15) LMK_A
- Outputs: Any unused output can be left floating with no trace connected.
- (near U15) CLK_SEL = 0: External
- CLK_SEL = 1: Onboard

### Library data of the parts
C61-C65 C67 C68 = CAP0402: Ceramic Capacitor 0402
C66 = CAP0201: Capacitor 0201 Imperial
FB2-FB4 = FB0402: Ferrite Bead 0402
R30-R33 = RES0201: Resistor-0201
U14 = OH320-CC-700503CF-010.0M: Oven Controlled Crystal Oscillator; Manufacturer_Name: onsemi; Manufacturer_Part_Number: BAT54SLT1G; Datasheet Link: http://www.onsemi.com/pub/Collateral/BAT54SLT1-D.PDF; Height: 1.11mm; Mouser Part Number: 863-BAT54SLT1G; Mouser Price/Stock: https://www.mouser.co.uk/ProductDetail/onsemi/BAT54SLT1G?qs=vLkC5FC1VN9oCh8qaBIZiQ%3D%3D; Arrow Part Number: BAT54SLT1G; Arrow Price/Stock: https://www.arrow.com/en/products/bat54slt1g/on-semiconductor?region=nac
U15 = LMK00804BPW: Low Skew, 1-to-4 Multiplexed Differential/LVCMOS-to-LVCMOS/TTL Fanout Buffer; Manufacturer_Name: Texas Instruments; Geometry.Height: 1.2mm; Manufacturer_Part_Number: LMK00804BPW; Mouser Part Number: 595-LMK00804BPW; Mouser Price/Stock: https://www.mouser.co.uk/ProductDetail/Texas-Instruments/LMK00804BPW?qs=NRIcxvoDUtdlTidVPGucWg%3D%3D; Arrow Part Number: LMK00804BPW; Arrow Price/Stock: https://www.arrow.com/en/products/lmk00804bpw/texas-instruments?region=nac; Datasheet Link: http://www.ti.com/general/docs/lit/getliterature.tsp?genericPartNumber=LMK00804B&&fileType=pdf

## Sheet LMX2820.SchDoc
size B; SheetNumber: 7; SheetTotal: 15
Used 2 times, as channels U_Clocking_and_LO/LMX2820_A, U_Clocking_and_LO/LMX2820_B. Parts and nets are listed once, with the designators drawn on the sheet.
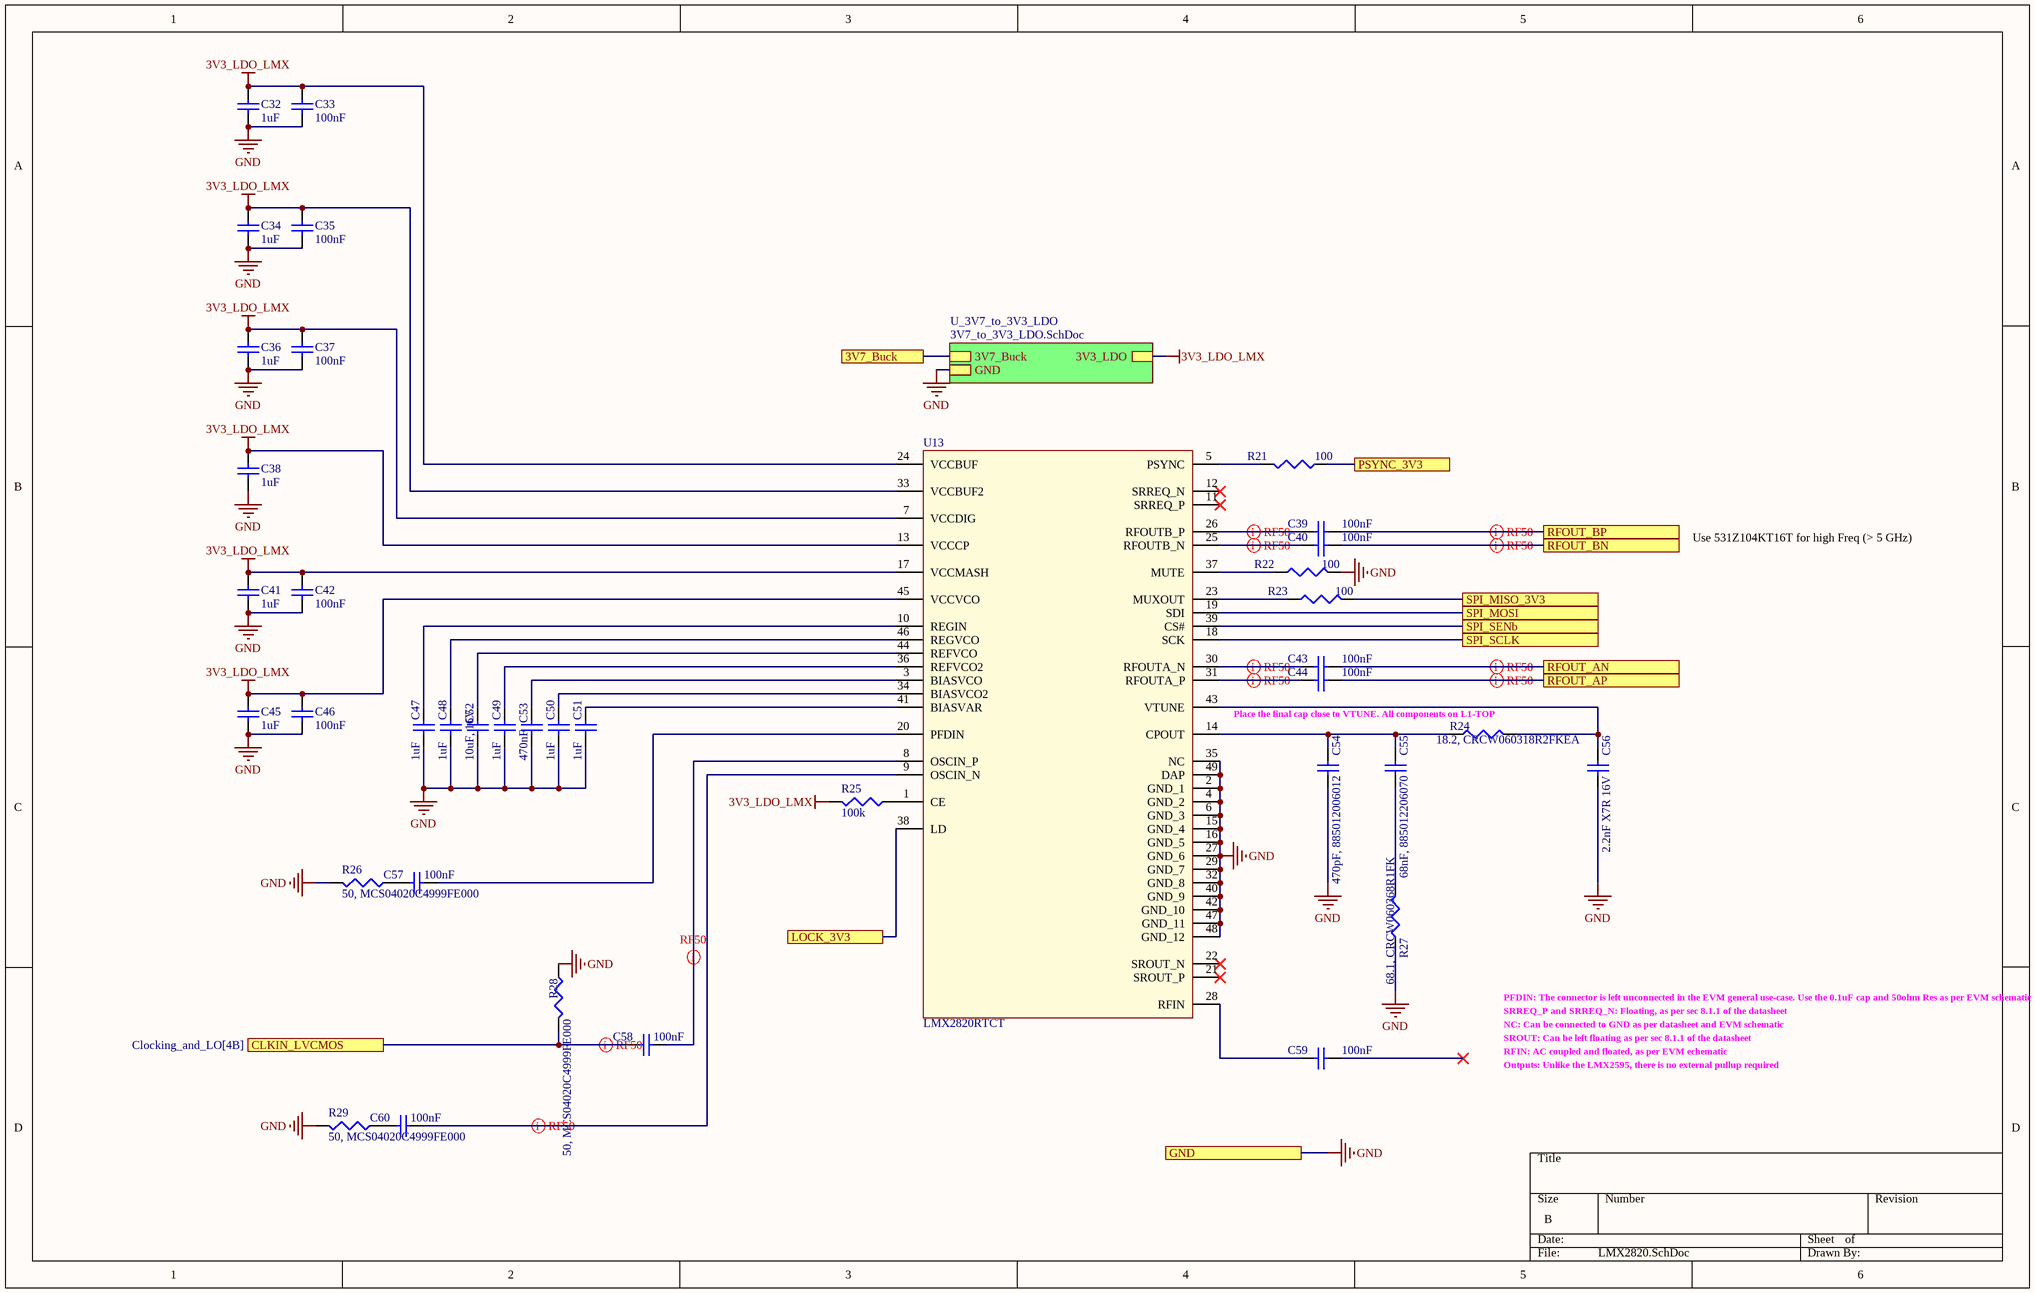
[diagram p6: LMX2820.SchDoc]

### Parts
C32  1uF  [SMD-0402]
C33  100nF  [SMD-0402]
C34  1uF  [SMD-0402]
C35  100nF  [SMD-0402]
C36  1uF  [SMD-0402]
C37  100nF  [SMD-0402]
C38  1uF  [SMD-0402]
C39  100nF  [Johanson-0201]
C40  100nF  [Johanson-0201]
C41  1uF  [SMD-0402]
C42  100nF  [SMD-0402]
C43  100nF  [Johanson-0201]
C44  100nF  [Johanson-0201]
C45  1uF  [SMD-0402]
C46  100nF  [SMD-0402]
C47  1uF  [SMD-0402]
C48  1uF  [SMD-0402]
C49  1uF  [SMD-0402]
C50  1uF  [SMD-0402]
C51  1uF  [SMD-0402]
C52  10uF, 16V  [SMD-0603]
C53  470nF  [SMD-0402]
C54  470pF, 885012006012  [SMD-0603]
C55  68nF, 885012206070  [SMD-0603]
C56  2.2nF X7R 16V  [SMD-0402]
C57  100nF  [SMD-0402]
C58  100nF  [SMD-0402]
C59  100nF  [SMD-0402]
C60  100nF  [SMD-0402]
R21  100  [SMD-0402]
R22  100  [SMD-0402]
R23  100  [SMD-0402]
R24  18.2, CRCW060318R2FKEA  [SMD-0603]
R25  100k  [SMD-0402]
R26  50, MCS04020C4999FE000  [SMD-0402]
R27  68.1, CRCW060368R1FK  [SMD-0603]
R28  50, MCS04020C4999FE000  [SMD-0402]
R29  50, MCS04020C4999FE000  [SMD-0402]
U13  LMX2820RTCT  [TI LMX2820]

### Sub-sheets
U_3V7_to_3V3_LDO = 3V7_to_3V3_LDO.SchDoc: 3V7_Buck, GND, 3V3_LDO

### Ports
3V7_Buck (see Clocking_and_LO[4B], 3V7_to_3V3_LDO[1A], Clocking_and_LO[1B]), CLKIN_LVCMOS (see Clocking_and_LO[4B]), GND (see Clocking_and_LO[5B], 3V7_to_3V3_LDO[1B], 5V5_to_5V0_LDO[1C], Buck_TPSM82913_1V8[3C], Buck_TPSM82913_3V7[3C], Buck_TPSM82913_5V0[3C], Buck_TPSM82913_5V5[2C], Clocking_and_LO[2A], Fan_Interfaces[2B], IQ_Demod[1C], IQ_Mod[1B], Microzed_Interfaces[1A], Power_Supply[6B], Voltage_Conv_Bidirectional[1B]), LOCK_3V3 (see Clocking_and_LO[5B]), PSYNC_3V3 (see Clocking_and_LO[4B]), RFOUT_AN (see Clocking_and_LO[5B]), RFOUT_AP (see Clocking_and_LO[5B]), RFOUT_BN (see Clocking_and_LO[5B]), RFOUT_BP (see Clocking_and_LO[5B]), SPI_MISO_3V3 (see Clocking_and_LO[4B]), SPI_MOSI (see Clocking_and_LO[4B]), SPI_SCLK (see Clocking_and_LO[4B]), SPI_SENb (see Clocking_and_LO[4B])

### Nets
3V3_LDO_LMX: C32.2 C33.2 C34.2 C35.2 C36.2 C37.2 C38.2 C41.2 C42.2 C45.2 C46.2 R25.2 U13.7(VCCDIG) U13.13(VCCCP) U13.17(VCCMASH) U13.24(VCCBUF) U13.33(VCCBUF2) U13.45(VCCVCO) ; sheet U_3V7_to_3V3_LDO/3V3_LDO
GND: C32.1 C33.1 C34.1 C35.1 C36.1 C37.1 C38.1 C41.1 C42.1 C45.1 C46.1 C47.1 C48.1 C49.1 C50.1 C51.1 C52.1 C53.1 C54.1 C56.1 R22.2 R26.2 R27.1 R28.1 R29.2 U13.2(GND_1) U13.4(GND_2) U13.6(GND_3) U13.15(GND_4) U13.16(GND_5) U13.27(GND_6) U13.29(GND_7) U13.32(GND_8) U13.35(NC) U13.40(GND_9) U13.42(GND_10) U13.47(GND_11) U13.48(GND_12) U13.49(DAP) ; port GND, sheet U_3V7_to_3V3_LDO/GND
3V7_Buck: port 3V7_Buck, sheet U_3V7_to_3V3_LDO/3V7_Buck
CLKIN_LVCMOS: C58.2 R28.2 ; port CLKIN_LVCMOS
LOCK_3V3: U13.38(LD) ; port LOCK_3V3
PSYNC_3V3: R21.1 ; port PSYNC_3V3
RFOUT_AN: C43.2 ; port RFOUT_AN
RFOUT_AP: C44.2 ; port RFOUT_AP
RFOUT_BN: C40.2 ; port RFOUT_BN
RFOUT_BP: C39.2 ; port RFOUT_BP
SPI_MISO_3V3: R23.2 ; port SPI_MISO_3V3
SPI_MOSI: U13.19(SDI) ; port SPI_MOSI
SPI_SCLK: U13.18(SCK) ; port SPI_SCLK
SPI_SENb: U13.39(CS#) ; port SPI_SENb
NetC39_1: C39.1 U13.26(RFOUTB_P)
NetC40_1: C40.1 U13.25(RFOUTB_N)
NetC43_1: C43.1 U13.30(RFOUTA_N)
NetC44_1: C44.1 U13.31(RFOUTA_P)
NetC47_2: C47.2 U13.10(REGIN)
NetC48_2: C48.2 U13.46(REGVCO)
NetC49_2: C49.2 U13.36(REFVCO2)
NetC50_2: C50.2 U13.34(BIASVCO2)
NetC51_2: C51.2 U13.41(BIASVAR)
NetC52_2: C52.2 U13.44(REFVCO)
NetC53_2: C53.2 U13.3(BIASVCO)
NetC54_2: C54.2 C55.2 R24.1 U13.14(CPOUT)
NetC55_1: C55.1 R27.2
NetC56_2: C56.2 R24.2 U13.43(VTUNE)
NetC57_1: C57.1 U13.20(PFDIN)
NetC57_2: C57.2 R26.1
NetC58_1: C58.1 U13.8(OSCIN_P)
NetC59_1: C59.1 U13.28(RFIN)
NetC60_1: C60.1 U13.9(OSCIN_N)
NetC60_2: C60.2 R29.1
NetR21_2: R21.2 U13.5(PSYNC)
NetR22_1: R22.1 U13.37(MUTE)
NetR23_1: R23.1 U13.23(MUXOUT)
NetR25_1: R25.1 U13.1(CE)

Not connected (* = marked no-connect by the designer): C59 2*; U13 11(SRREQ_P)* 12(SRREQ_N)* 21(SROUT_P)* 22(SROUT_N)*

### Channels
U_Clocking_and_LO/LMX2820_A: designators end in _1; ports 3V7_Buck=3V7_Buck CLKIN_LVCMOS=NetC58_1_2 GND=GND LOCK_3V3=LMX_A_LD_3V3 PSYNC_3V3=LMX_A_PSYNC_1V8 RFOUT_AN=LO_A_N RFOUT_AP=LO_A_P RFOUT_BN=NetC40_1_2 RFOUT_BP=NetC39_1_2 SPI_MISO_3V3=SPI_MISO_3V3 SPI_MOSI=SPI_MOSI_1V8 SPI_SCLK=SPI_SCLK_1V8 SPI_SENb=SPI_LMX_A_SENb_1V8
U_Clocking_and_LO/LMX2820_B: designators end in _2; ports 3V7_Buck=3V7_Buck CLKIN_LVCMOS=NetC58_2_2 GND=GND LOCK_3V3=LMX_B_LD_3V3 PSYNC_3V3=LMX_B_PSYNC_1V8 RFOUT_AN=LO_B_N RFOUT_AP=LO_B_P RFOUT_BN=NetC40_2_2 RFOUT_BP=NetC39_2_2 SPI_MISO_3V3=SPI_MISO_3V3 SPI_MOSI=SPI_MOSI_1V8 SPI_SCLK=SPI_SCLK_1V8 SPI_SENb=SPI_LMX_B_SENb_1V8

### Layout directives
net class RF50: LO_A_N, LO_A_P, NetC39_1_1, NetC39_1_2, NetC40_1_1, NetC40_1_2, NetC43_1_1, NetC44_1_1, NetC58_1_1, NetC58_1_2, NetC60_1_1

### Notes on the sheet
- Use 531Z104KT16T for high Freq (> 5 GHz)
- (near R24) Place the final cap close to VTUNE. All components on L1-TOP
- PFDIN: The connector is left unconnected in the EVM general use-case. Use the 0.1uF cap and 50ohm Res as per EVM schematic
- SRREQ_P and SRREQ_N: Floating, as per sec 8.1.1 of the datasheet
- NC: Can be connected to GND as per datasheet and EVM schematic
- SROUT: Can be left floating as per sec 8.1.1 of the datasheet
- RFIN: AC coupled and floated, as per EVM echematic
- Outputs: Unlike the LMX2595, there is no external pullup required

### Library data of the parts
C32-C38 C41 C42 C45-C51 C53 C56-C60 = CAP0402: Ceramic Capacitor 0402
C39 C40 C43 C44 = CAP0201: Capacitor 0201 Imperial
C52 C54 C55 = CAP0603: Ceramic Capacitor 0603
R21-R23 R25 R26 R28 R29 = RES0402: Resistor-0402
R24 R27 = RES0603: Resistor-0603
U13 = LMX2820RTCT: Phase Locked Loops - PLL 22.6-GHz wideband RF synthesizer with phase synchronization, JESD and <5- us frequency calibration 48-VQFN -40 to 85; Manufacturer_Name: Texas Instruments; Geometry.Height: 0.9mm; Manufacturer_Part_Number: LMX2820RTCT; Mouser Part Number: 595-LMX2820RTCT; Mouser Price/Stock: https://www.mouser.co.uk/ProductDetail/Texas-Instruments/LMX2820RTCT?qs=eP2BKZSCXI4hpj09QD%252Biqg%3D%3D; Arrow Part Number: LMX2820RTCT; Arrow Price/Stock: https://www.arrow.com/en/products/lmx2820rtct/texas-instruments?region=nac; Mouser Testing Part Number: *; Mouser Testing Price/Stock: *; Datasheet Link: https://www.ti.com/lit/ds/symlink/lmx2820.pdf?ts=1616090349546&ref_url=https%253A%252F%252Fwww.ti.com%252Fstore%252Fti%252Fen%252Fp%252Fproduct%252F%253Fp%253DLMX2820RTCT

## Sheet Power_Supply.SchDoc
size B; SheetNumber: 11; SheetTotal: 15
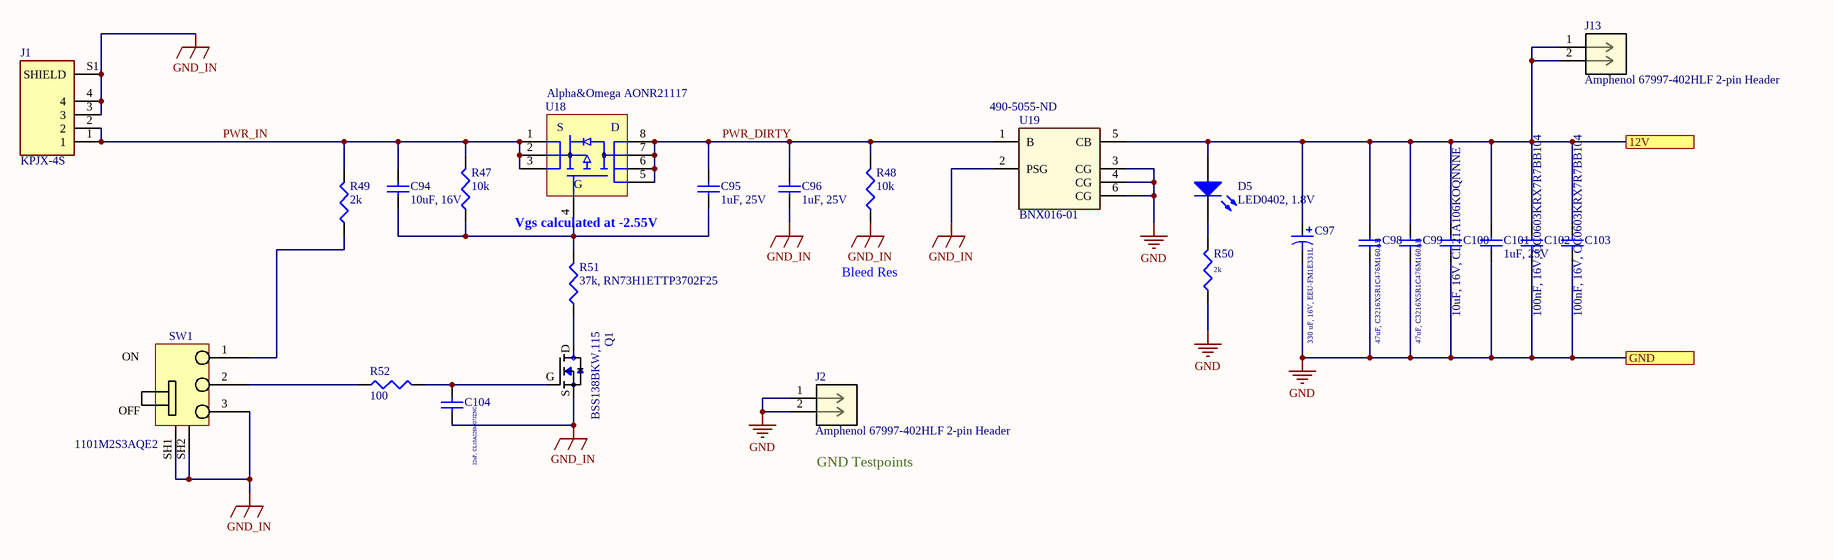
[diagram p7: Power_Supply.SchDoc]

### Parts
C94  10uF, 16V  [SMD-0603]
C95  1uF, 25V  [SMD-0603]
C96  1uF, 25V  [SMD-0603]
C97  330 uF, 16V, EEU-FM1E331L  [CAP-AXIAL-8.0-3.5]
C98  47uF, C3216X5R1C476M160AB  [SMD-1206]
C99  47uF, C3216X5R1C476M160AB  [SMD-1206]
C100  10uF, 16V, CL21A106KOQNNNE  [SMD-0805]
C101  1uF, 25V  [SMD-0603]
C102  100nF, 16V, CC0603KRX7R7BB104  [SMD-0603]
C103  100nF, 16V, CC0603KRX7R7BB104  [SMD-0603]
C104  22uF, CL10A226MO7JZNC  [SMD-0603]
D5  LED0402, 1.8V  [LED-0402]
J1  KPJX-4S  [KYCON_KPJX-4S]
J2  Amphenol 67997-402HLF 2-pin Header  [Amphenol  67997-402HLF 2-pin header]
J13  Amphenol 67997-402HLF 2-pin Header  [Amphenol  67997-402HLF 2-pin header]
Q1  BSS138BKW,115  [BSS138BKW,115]
R47  10k  [SMD-0402]
R48  10k  [SMD-0402]
R49  2k  [SMD-0402]
R50  2k  [SMD-0402]
R51  37k, RN73H1ETTP3702F25  [SMD-0402]
R52  100  [SMD-0402]
SW1  1101M2S3AQE2  [1101M2S3ABE2]
U18  Alpha&Omega AONR21117  [Alpha&Omega_AONR21321]
U19  BNX016-01  Supplier Part Number 1: 490-5055-ND  [FIL_BNX016-01]

### Ports
12V (see Main[2C]), GND (see Main[2C], 3V7_to_3V3_LDO[1B], 5V5_to_5V0_LDO[1C], Buck_TPSM82913_1V8[3C], Buck_TPSM82913_3V7[3C], Buck_TPSM82913_5V0[3C], Buck_TPSM82913_5V5[2C], Clocking_and_LO[2A], Fan_Interfaces[2B], IQ_Demod[1C], IQ_Mod[1B], LMX2820[4D], Microzed_Interfaces[1A], Voltage_Conv_Bidirectional[1B])

### Nets
12V0: C97.1 C98.2 C99.2 C100.2 C101.2 C102.2 C103.2 D5.1(A) J13.1 J13.2 U19.5(CB) ; port 12V
GND: C97.2 C98.1 C99.1 C100.1 C101.1 C102.1 C103.1 J2.1 J2.2 R50.1 U19.3(CG) U19.4(CG) U19.6(CG) ; port GND
GND_IN: C96.1 C104.1 J1.3 J1.4 J1.S1(SHIELD) Q1.S R48.1 SW1.3 SW1.SH1 SW1.SH2 U19.2(PSG)
PWR_DIRTY: C95.2 C96.2 R48.2 U18.5 U18.6 U18.7 U18.8 U19.1(B)
PWR_IN: C94.2 J1.1 J1.2 R47.2 R49.2 U18.1 U18.2 U18.3
NetC94_1: C94.1 C95.1 R47.1 R51.2 U18.4
NetC104_2: C104.2 Q1.G R52.2
NetD5_2: D5.2(K) R50.2
NetQ1_D: Q1.D R51.1
NetR49_1: R49.1 SW1.1
NetR52_1: R52.1 SW1.2

### Notes on the sheet
- Vgs calculated at -2.55V
- Bleed Res
- (near J2) GND Testpoints
- (in symbol 11-1M2S3AQE2) ON; OFF
- (in symbol Alpha&Omega AONR21117) S; D; G

### Library data of the parts
C94 C102-C104 = CAP0603: Ceramic Capacitor 0603
C95 C96 C101 = CAP0603_HV: Ceramic Capacitor 0603, 25V
C97 = CAP_ELECTRO: CAP ALUM 330UF 20% 25V RADIAL EEU-FM1E331
C98 C99 = CAP1206: Ceramic Capacitor 1206 Imperial
C100 = CAP0805: Ceramic Capacitor 0805 Imperial (2012 Metric)
D5 = LED0402: LED 0402
J1 = KPJX-4S: 4 _Power_ Position Circular Connector Jack, Female Sockets Solder; MF: Kycon; Value: *; Package: DIP-20 Kycon; Price: None; MP: KPJX-4S; Availability: Unavailable; SnapEDA_Link: https://www.snapeda.com/parts/KPJX-4S/Kycon/view-part/555404/?ref=snap
J2 J13 = Amphenol 67997-402HLF 2-pin Header: No Description Available; Mfr_Name: Amphenol ICC; RefDes: RefDes; Type: Type
Q1 = BSS138: N-Channel Logic Level Enhancement Mode Field Effect Transistor; MF: MICROSS/On Semiconductor; MP: BSS138; Price: None; Availability: Unavailable; Package: TO-236-3 Micross; SnapEDA_Link: https://www.snapeda.com/parts/BSS138/MICROSS/On%20Semiconductor/view-part/?ref=snap; Value: *
R47-R52 = RES0402: Resistor-0402
SW1 = 11-1M2S3AQE2: SPDT, RIGHT ANGLE, PC THRU-HOLE; pin to pad: SH1>4 SH2>5
U18 = Alpha&Omega AONR21117: P-Channel 20-V (D-S) MOSFET
U19 = BNX016-01: Filter: anti-interference; wideband; Mounting: THT; 15A; -40Ã·125Â°; MF: Murata Electronics; MP: BNX016-01; Digi-Key_Purchase_URL: https://www.digikey.com/product-detail/en/murata-electronics/BNX016-01/490-5055-ND/1825576?utm_source=snapeda&utm_medium=aggregator&utm_campaign=symbol; Package: Block-4 Murata; SnapEDA_Link: https://www.snapeda.com/parts/BNX016-01/Murata%20Electronics%20North%20America/view-part/?ref=snap; Digi-Key_Part_Number: 490-5055-ND; Value: *; Supplier 1: Digi-Key

## Sheet Microzed_Interfaces.SchDoc
size C; SheetNumber: 8; SheetTotal: 14
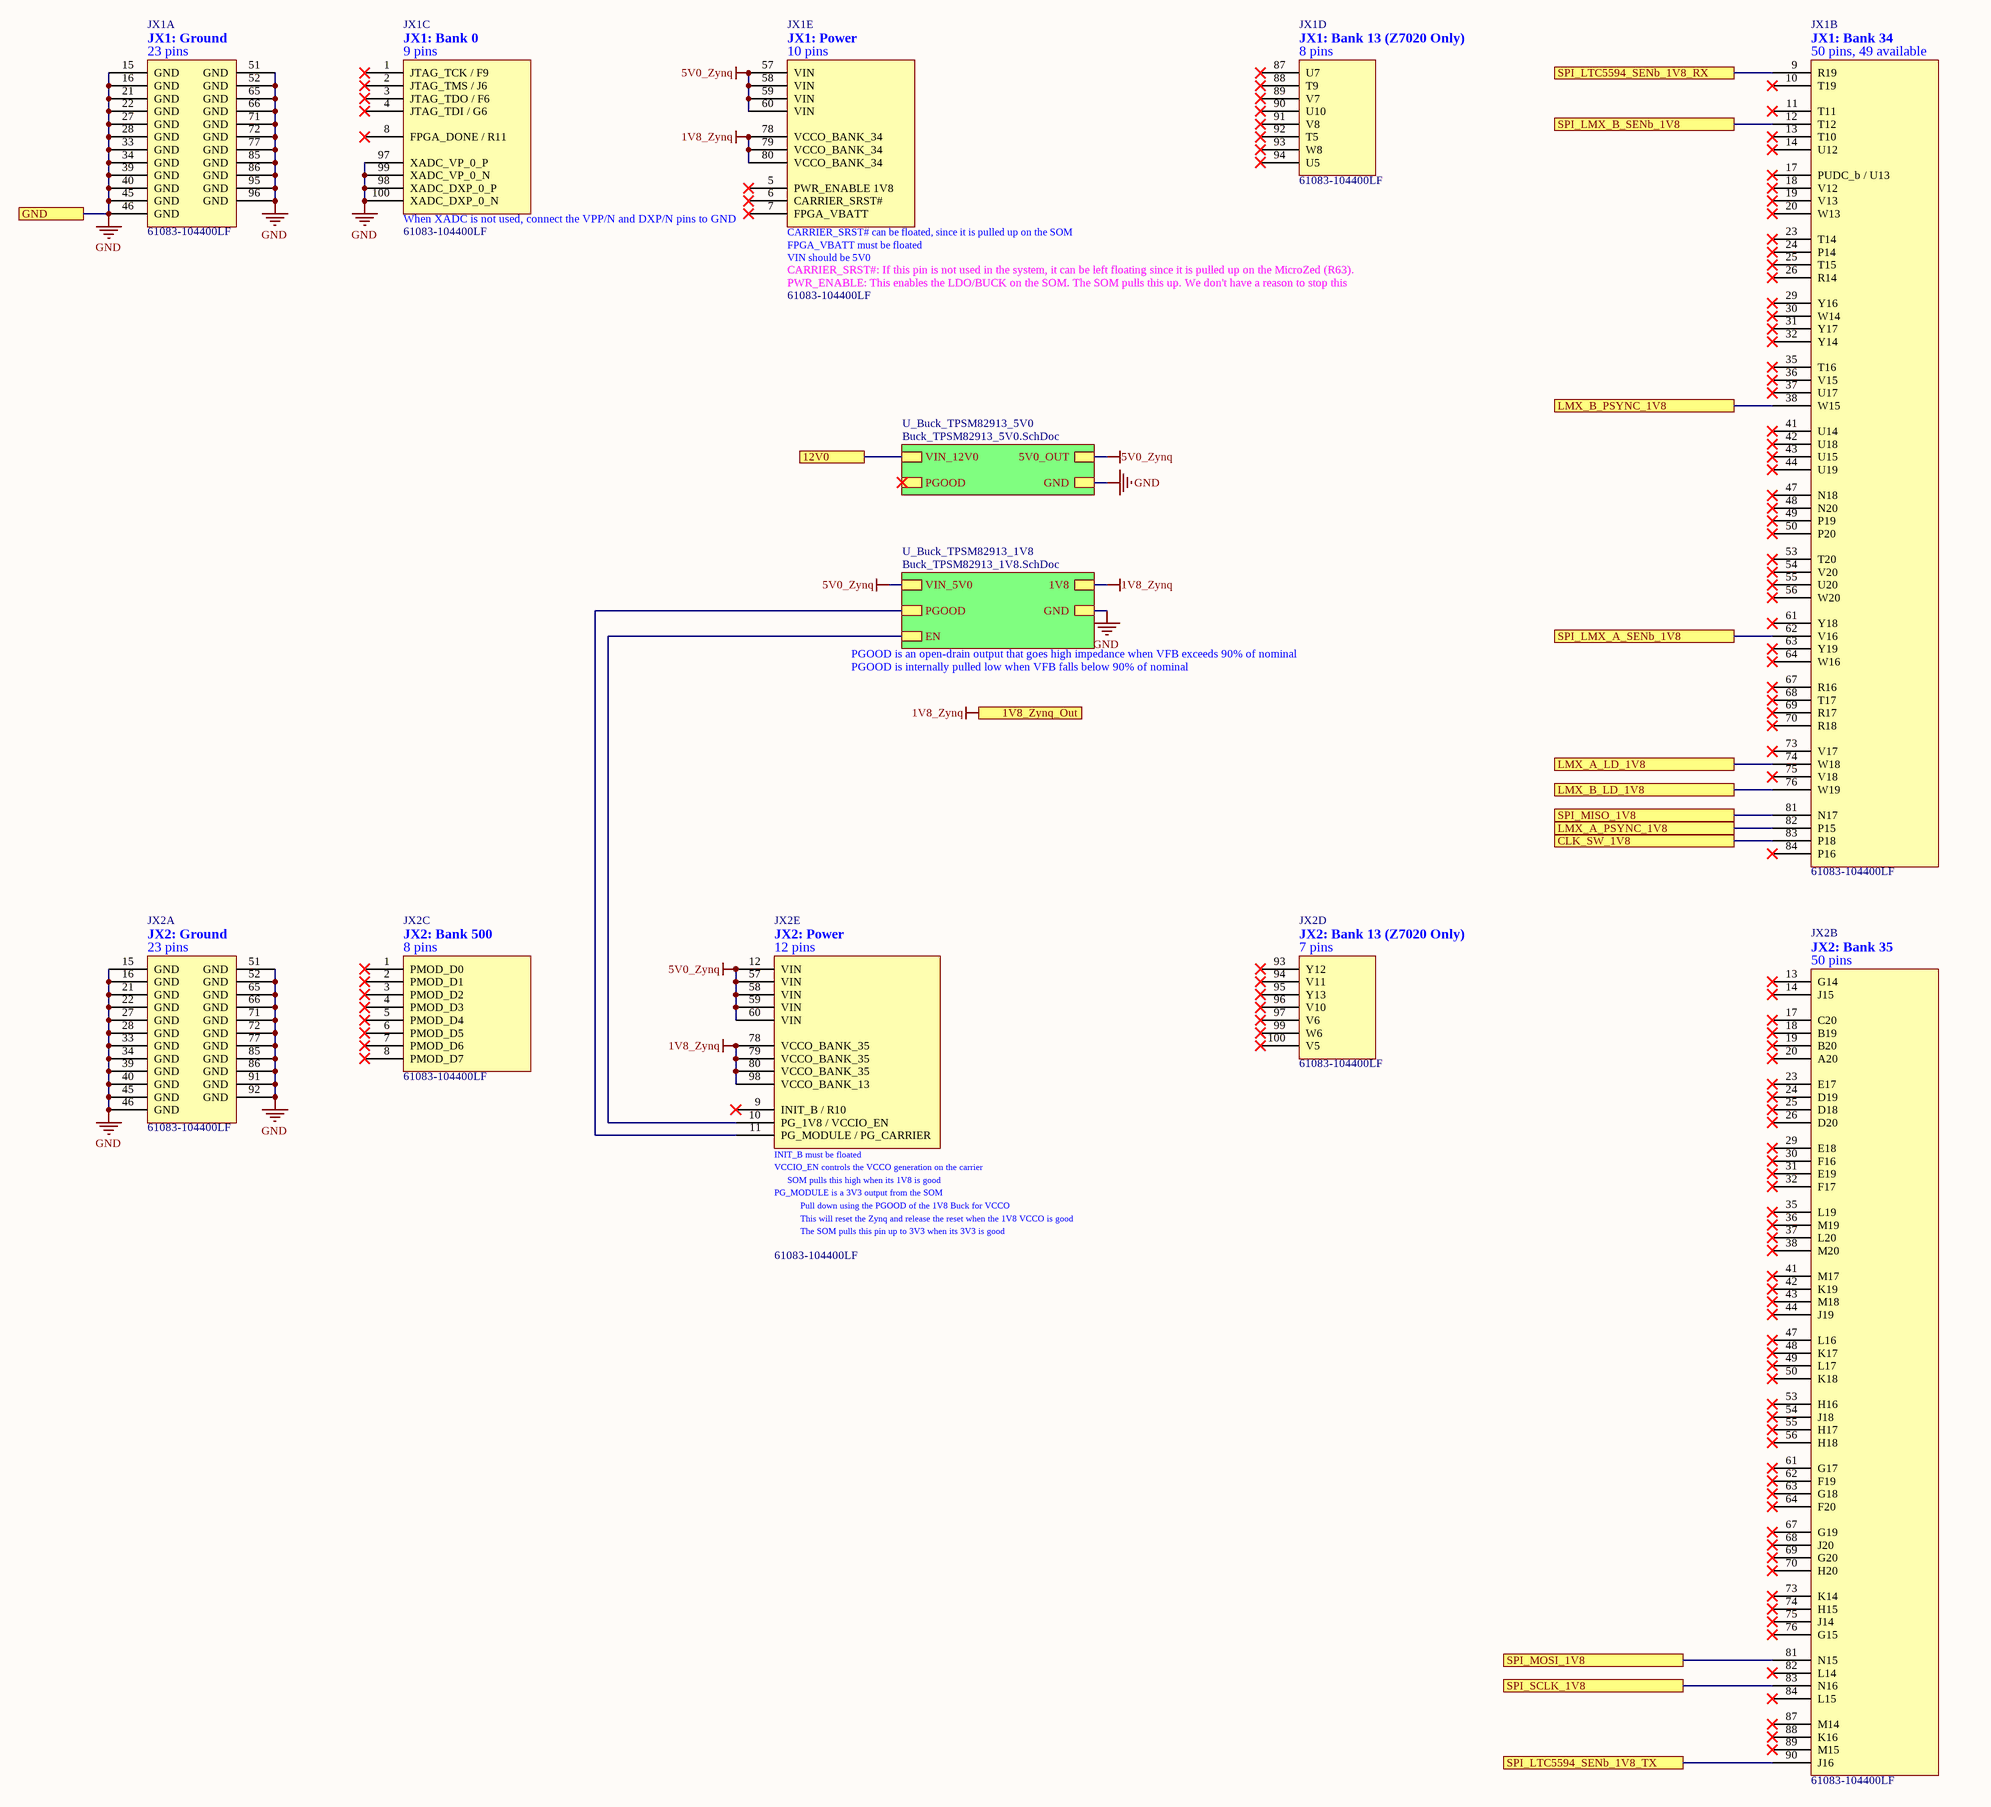
[diagram p8: Microzed_Interfaces.SchDoc]

### Parts
JX1  61083-104400LF  [Bergstak FCI_61083-101400LF]  (parts A,B,C,D,E of 5)
JX2  61083-104400LF  [Bergstak FCI_61083-101400LF]  (parts A,B,C,D,E of 5)

### Sub-sheets
U_Buck_TPSM82913_1V8 = Buck_TPSM82913_1V8.SchDoc: GND, VIN_5V0, PGOOD, 1V8, EN
U_Buck_TPSM82913_5V0 = Buck_TPSM82913_5V0.SchDoc: GND, VIN_12V0, PGOOD, 5V0_OUT

### Ports
1V8_Zynq_Out (see Main[4A]), 12V0 (see Main[4A]), CLK_SW_1V8 (see Main[5A]), GND (see Main[4A], 3V7_to_3V3_LDO[1B], 5V5_to_5V0_LDO[1C], Buck_TPSM82913_1V8[3C], Buck_TPSM82913_3V7[3C], Buck_TPSM82913_5V0[3C], Buck_TPSM82913_5V5[2C], Clocking_and_LO[2A], IQ_Demod[1C], IQ_Mod[1B], LMX2820[4D], Power_Supply[6B], Voltage_Conv_Bidirectional[1B]), LMX_A_LD_1V8 (see Main[4A]), LMX_A_PSYNC_1V8 (see Main[5A]), LMX_B_LD_1V8 (see Main[4A]), LMX_B_PSYNC_1V8 (see Main[5A]), SPI_LMX_A_SENb_1V8 (see Main[5A], Clocking_and_LO[4B]), SPI_LMX_B_SENb_1V8 (see Main[5A], Clocking_and_LO[4C]), SPI_LTC5594_SENb_1V8_RX (see Main[5A]), SPI_LTC5594_SENb_1V8_TX (see Main[5A]), SPI_MISO_1V8 (see Main[5A]), SPI_MOSI_1V8 (see Main[5A], Clocking_and_LO[4B]), SPI_SCLK_1V8 (see Main[5A], Clocking_and_LO[4B])

### Nets
1V8_Zynq: JX1.78(VCCO_BANK_34) JX1.79(VCCO_BANK_34) JX1.80(VCCO_BANK_34) JX2.78(VCCO_BANK_35) JX2.79(VCCO_BANK_35) JX2.80(VCCO_BANK_35) JX2.98(VCCO_BANK_13) ; port 1V8_Zynq_Out, sheet U_Buck_TPSM82913_1V8/1V8  [project net 1V8]
5V0_Zynq: JX1.57(VIN) JX1.58(VIN) JX1.59(VIN) JX1.60(VIN) JX2.12(VIN) JX2.57(VIN) JX2.58(VIN) JX2.59(VIN) JX2.60(VIN) ; sheet U_Buck_TPSM82913_5V0/5V0_OUT, sheet U_Buck_TPSM82913_1V8/VIN_5V0
12V0: port 12V0, sheet U_Buck_TPSM82913_5V0/VIN_12V0
GND: JX1.15(GND) JX1.16(GND) JX1.21(GND) JX1.22(GND) JX1.27(GND) JX1.28(GND) JX1.33(GND) JX1.34(GND) JX1.39(GND) JX1.40(GND) JX1.45(GND) JX1.46(GND) JX1.51(GND) JX1.52(GND) JX1.65(GND) JX1.66(GND) JX1.71(GND) JX1.72(GND) JX1.77(GND) JX1.85(GND) JX1.86(GND) JX1.95(GND) JX1.96(GND) JX1.97(XADC_VP_0_P) JX1.98(XADC_DXP_0_P) JX1.99(XADC_VP_0_N) JX1.100(XADC_DXP_0_N) JX2.15(GND) JX2.16(GND) JX2.21(GND) JX2.22(GND) JX2.27(GND) JX2.28(GND) JX2.33(GND) JX2.34(GND) JX2.39(GND) JX2.40(GND) JX2.45(GND) JX2.46(GND) JX2.51(GND) JX2.52(GND) JX2.65(GND) JX2.66(GND) JX2.71(GND) JX2.72(GND) JX2.77(GND) JX2.85(GND) JX2.86(GND) JX2.91(GND) JX2.92(GND) ; port GND, sheet U_Buck_TPSM82913_5V0/GND, sheet U_Buck_TPSM82913_1V8/GND
CLK_SW_1V8: JX1.83(P18) ; port CLK_SW_1V8
LMX_A_LD_1V8: JX1.74(W18) ; port LMX_A_LD_1V8
LMX_A_PSYNC_1V8: JX1.82(P15) ; port LMX_A_PSYNC_1V8
LMX_B_LD_1V8: JX1.76(W19) ; port LMX_B_LD_1V8
LMX_B_PSYNC_1V8: JX1.38(W15) ; port LMX_B_PSYNC_1V8
SPI_5594_RX_SENb_1V8: JX1.9(R19) ; port SPI_LTC5594_SENb_1V8_RX
SPI_5594_TX_SENb_1V8: JX2.90(J16) ; port SPI_LTC5594_SENb_1V8_TX
SPI_LMX_A_SENb_1V8: JX1.62(V16) ; port SPI_LMX_A_SENb_1V8
SPI_LMX_B_SENb_1V8: JX1.12(T12) ; port SPI_LMX_B_SENb_1V8
SPI_MISO_1V8: JX1.81(N17) ; port SPI_MISO_1V8
SPI_MOSI_1V8: JX2.81(N15) ; port SPI_MOSI_1V8
SPI_SCLK_1V8: JX2.83(N16) ; port SPI_SCLK_1V8
NetJX2_10: JX2.10(PG_1V8_/_VCCIO_EN) ; sheet U_Buck_TPSM82913_1V8/EN
NetJX2_11: JX2.11(PG_MODULE_/_PG_CARRIER) ; sheet U_Buck_TPSM82913_1V8/PGOOD

Not connected (* = marked no-connect by the designer): JX1 1(JTAG_TCK_/_F9)* 2(JTAG_TMS_/_J6)* 3(JTAG_TDO_/_F6)* 4(JTAG_TDI_/_G6)* 5(PWR_ENABLE_1V8)* 6(CARRIER_SRST#)* 7(FPGA_VBATT)* 8(FPGA_DONE_/_R11)* 10(T19)* 11(T11)* 13(T10)* 14(U12)* 17(PUDC_b_/_U13)* 18(V12)* 19(V13)* 20(W13)* 23(T14)* 24(P14)* 25(T15)* 26(R14)* 29(Y16)* 30(W14)* 31(Y17)* 32(Y14)* 35(T16)* 36(V15)* 37(U17)* 41(U14)* 42(U18)* 43(U15)* 44(U19)* 47(N18)* 48(N20)* 49(P19)* 50(P20)* 53(T20)* 54(V20)* 55(U20)* 56(W20)* 61(Y18)* 63(Y19)* 64(W16)* 67(R16)* 68(T17)* 69(R17)* 70(R18)* 73(V17)* 75(V18)* 84(P16)* 87(U7)* 88(T9)* 89(V7)* 90(U10)* 91(V8)* 92(T5)* 93(W8)* 94(U5)*; JX2 1(PMOD_D0)* 2(PMOD_D1)* 3(PMOD_D2)* 4(PMOD_D3)* 5(PMOD_D4)* 6(PMOD_D5)* 7(PMOD_D6)* 8(PMOD_D7)* 9(INIT_B_/_R10)* 13(G14)* 14(J15)* 17(C20)* 18(B19)* 19(B20)* 20(A20)* 23(E17)* 24(D19)* 25(D18)* 26(D20)* 29(E18)* 30(F16)* 31(E19)* 32(F17)* 35(L19)* 36(M19)* 37(L20)* 38(M20)* 41(M17)* 42(K19)* 43(M18)* 44(J19)* 47(L16)* 48(K17)* 49(L17)* 50(K18)* 53(H16)* 54(J18)* 55(H17)* 56(H18)* 61(G17)* 62(F19)* 63(G18)* 64(F20)* 67(G19)* 68(J20)* 69(G20)* 70(H20)* 73(K14)* 74(H15)* 75(J14)* 76(G15)* 82(L14)* 84(L15)* 87(M14)* 88(K16)* 89(M15)* 93(Y12)* 94(V11)* 95(Y13)* 96(V10)* 97(V6)* 99(W6)* 100(V5)*

### Notes on the sheet
- CARRIER_SRST#: If this pin is not used in the system, it can be left floating since it is pulled up on the MicroZed (R63).
- PWR_ENABLE: This enables the LDO/BUCK on the SOM. The SOM pulls this up. We don't have a reason to stop this
- PGOOD is an open-drain output that goes high impedance when VFB exceeds 90% of nominal
- PGOOD is internally pulled low when VFB falls below 90% of nominal
- The SOM pulls this pin up to 3V3 when its 3V3 is good
- (in symbol MicroZed JX1, part A) JX1: Ground; 23 pins
- (in symbol MicroZed JX1, part B) JX1: Bank 34; 50 pins, 49 available
- (in symbol MicroZed JX1, part C) JX1: Bank 0; 9 pins; When XADC is not used, connect the VPP/N and DXP/N pins to GND
- (in symbol MicroZed JX1, part D) JX1: Bank 13 (Z7020 Only); 8 pins
- (in symbol MicroZed JX1, part E) JX1: Power; 10 pins; CARRIER_SRST# can be floated, since it is pulled up on the SOM; FPGA_VBATT must be floated; VIN should be 5V0
- (in symbol MicroZed JX2, part A) JX2: Ground; 23 pins
- (in symbol MicroZed JX2, part B) JX2: Bank 35; 50 pins
- (in symbol MicroZed JX2, part C) JX2: Bank 500; 8 pins
- (in symbol MicroZed JX2, part D) JX2: Bank 13 (Z7020 Only); 7 pins
- (in symbol MicroZed JX2, part E) JX2: Power; 12 pins; INIT_B must be floated; VCCIO_EN controls the VCCO generation on the carrier; SOM pulls this high when its 1V8 is good; PG_MODULE is a 3V3 output from the SOM; Pull down using the PGOOD of the 1V8 Buck for VCCO; This will reset the Zynq and release the reset when the 1V8 VCCO is good

### Library data of the parts
JX1 = MicroZed JX1: Bergstak FCI 61083-104400LF
JX2 = MicroZed JX2: Bergstak FCI 61083-104400LF

## Sheet Buck_TPSM82913_5V0.SchDoc
size B; SheetNumber: 9; SheetTotal: 15
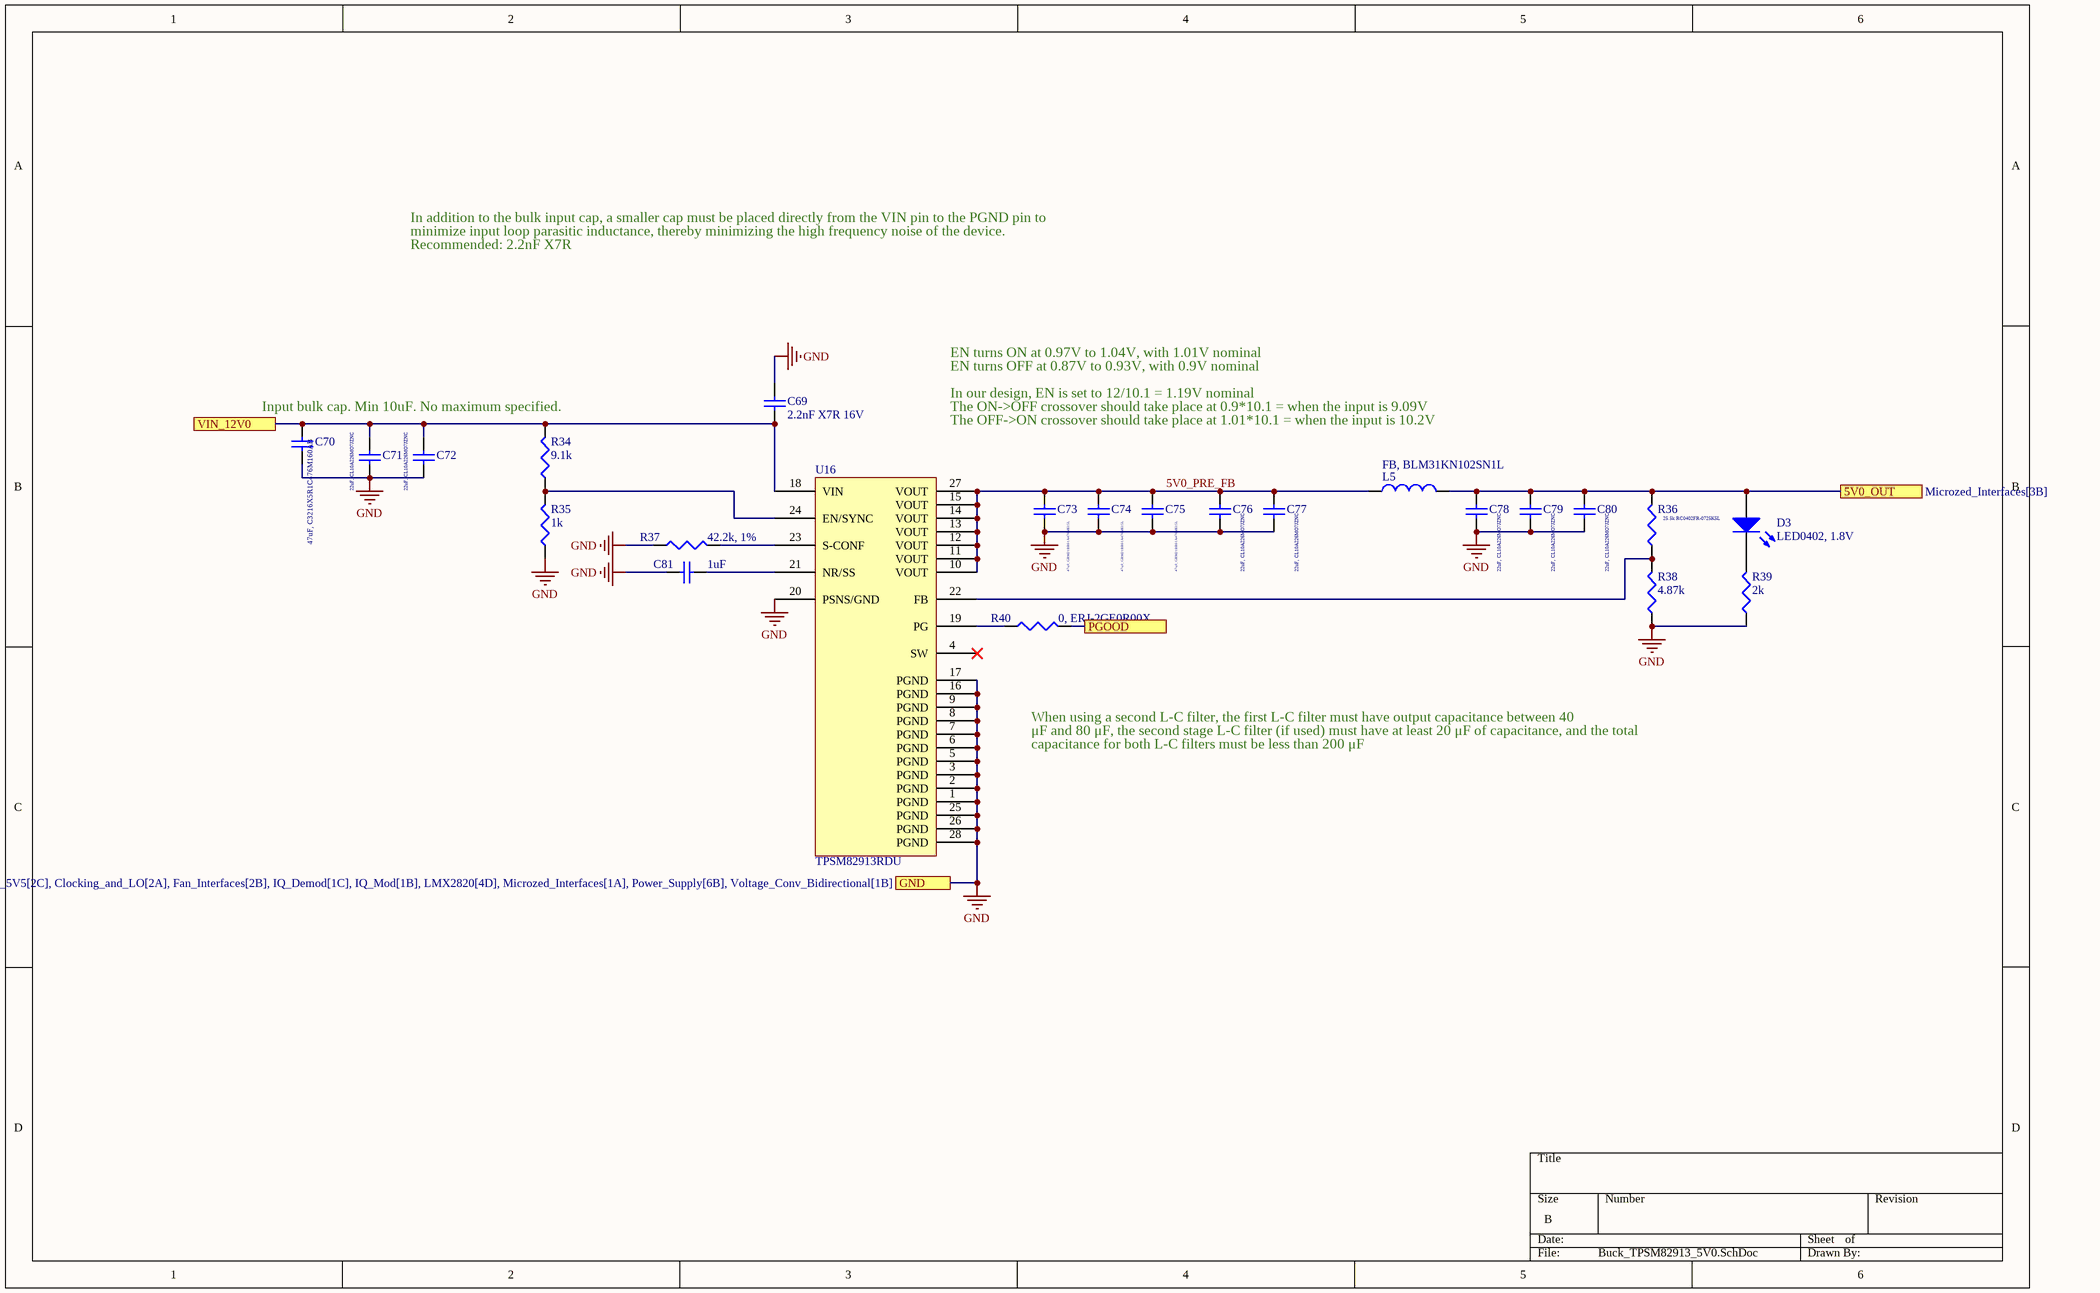
[diagram p9: Buck_TPSM82913_5V0.SchDoc]

### Parts
C69  2.2nF X7R 16V  [SMD-0402]
C70  47uF, C3216X5R1C476M160AB  [SMD-1206]
C71  22uF, CL10A226MO7JZNC  [SMD-0603]
C72  22uF, CL10A226MO7JZNC  [SMD-0603]
C73  47uF, GRM21BR61A476ME15L  [SMD-0805]
C74  47uF, GRM21BR61A476ME15L  [SMD-0805]
C75  47uF, GRM21BR61A476ME15L  [SMD-0805]
C76  22uF, CL10A226MO7JZNC  [SMD-0603]
C77  22uF, CL10A226MO7JZNC  [SMD-0603]
C78  22uF, CL10A226MO7JZNC  [SMD-0603]
C79  22uF, CL10A226MO7JZNC  [SMD-0603]
C80  22uF, CL10A226MO7JZNC  [SMD-0603]
C81  1uF  [SMD-0402]
D3  LED0402, 1.8V  [LED-0402]
L5  FB, BLM31KN102SN1L  [SMD-1206]
R34  9.1k  [SMD-0402]
R35  1k  [SMD-0402]
R36  25.5k RC0402FR-0725K5L  [SMD-0402]
R37  42.2k, 1%  [SMD-0402]
R38  4.87k  [SMD-0402]
R39  2k  [SMD-0402]
R40  0, ERJ-2GE0R00X  [SMD-0402]
U16  TPSM82913RDU  [TPSM82913DRUR]

### Ports
5V0_OUT (see Microzed_Interfaces[3B]), GND (see Microzed_Interfaces[3B], 3V7_to_3V3_LDO[1B], 5V5_to_5V0_LDO[1C], Buck_TPSM82913_1V8[3C], Buck_TPSM82913_3V7[3C], Buck_TPSM82913_5V5[2C], Clocking_and_LO[2A], Fan_Interfaces[2B], IQ_Demod[1C], IQ_Mod[1B], LMX2820[4D], Microzed_Interfaces[1A], Power_Supply[6B], Voltage_Conv_Bidirectional[1B]), PGOOD (see Microzed_Interfaces[3B]), VIN_12V0 (see Microzed_Interfaces[3B], Buck_TPSM82913_3V7[1B], Buck_TPSM82913_5V5[1B])

### Nets
5V0_Zynq: C78.2 C79.2 C80.2 D3.1(A) L5.2 R36.2 ; port 5V0_OUT
12V0: C69.1 C70.2 C71.2 C72.2 R34.2 U16.18(VIN) ; port VIN_12V0
GND: C69.2 C70.1 C71.1 C72.1 C73.1 C74.1 C75.1 C76.1 C77.1 C78.1 C79.1 C80.1 C81.1 R35.1 R37.1 R38.1 R39.1 U16.1(PGND) U16.2(PGND) U16.3(PGND) U16.5(PGND) U16.6(PGND) U16.7(PGND) U16.8(PGND) U16.9(PGND) U16.16(PGND) U16.17(PGND) U16.20(PSNS/GND) U16.25(PGND) U16.26(PGND) U16.28(PGND) ; port GND
5V0_PRE_FB: C73.2 C74.2 C75.2 C76.2 C77.2 L5.1 U16.10(VOUT) U16.11(VOUT) U16.12(VOUT) U16.13(VOUT) U16.14(VOUT) U16.15(VOUT) U16.27(VOUT)
NetC81_2: C81.2 U16.21(NR/SS)
NetD3_2: D3.2(K) R39.2
NetR34_1: R34.1 R35.2 U16.24(EN/SYNC)
NetR36_1: R36.1 R38.2 U16.22(FB)
NetR37_2: R37.2 U16.23(S-CONF)
NetR40_1: R40.1 U16.19(PG)
NetR40_2: R40.2 ; port PGOOD

Not connected (* = marked no-connect by the designer): U16 4(SW)*

### Notes on the sheet
- In addition to the bulk input cap, a smaller cap must be placed directly from the VIN pin to the PGND pin to
- minimize input loop parasitic inductance, thereby minimizing the high frequency noise of the device.
- Recommended: 2.2nF X7R
- EN turns OFF at 0.87V to 0.93V, with 0.9V nominal
- EN turns ON at 0.97V to 1.04V, with 1.01V nominal
- Input bulk cap. Min 10uF. No maximum specified.
- In our design, EN is set to 12/10.1 = 1.19V nominal
- The ON->OFF crossover should take place at 0.9*10.1 = when the input is 9.09V
- The OFF->ON crossover should take place at 1.01*10.1 = when the input is 10.2V
- When using a second L-C filter, the first L-C filter must have output capacitance between 40
- μF and 80 μF, the second stage L-C filter (if used) must have at least 20 μF of capacitance, and the total
- capacitance for both L-C filters must be less than 200 μF

### Library data of the parts
C69 C81 = CAP0402: Ceramic Capacitor 0402
C70 = CAP1206: Ceramic Capacitor 1206 Imperial
C71 C72 C76-C80 = CAP0603: Ceramic Capacitor 0603
C73-C75 = CAP0805: as C100 on sheet Power_Supply
D3 = LED0402: LED 0402
L5 = L1206: Inductor 1206
R34-R40 = RES0402: Resistor-0402

## Sheet Buck_TPSM82913_1V8.SchDoc
size B; SheetNumber: 10; SheetTotal: 15
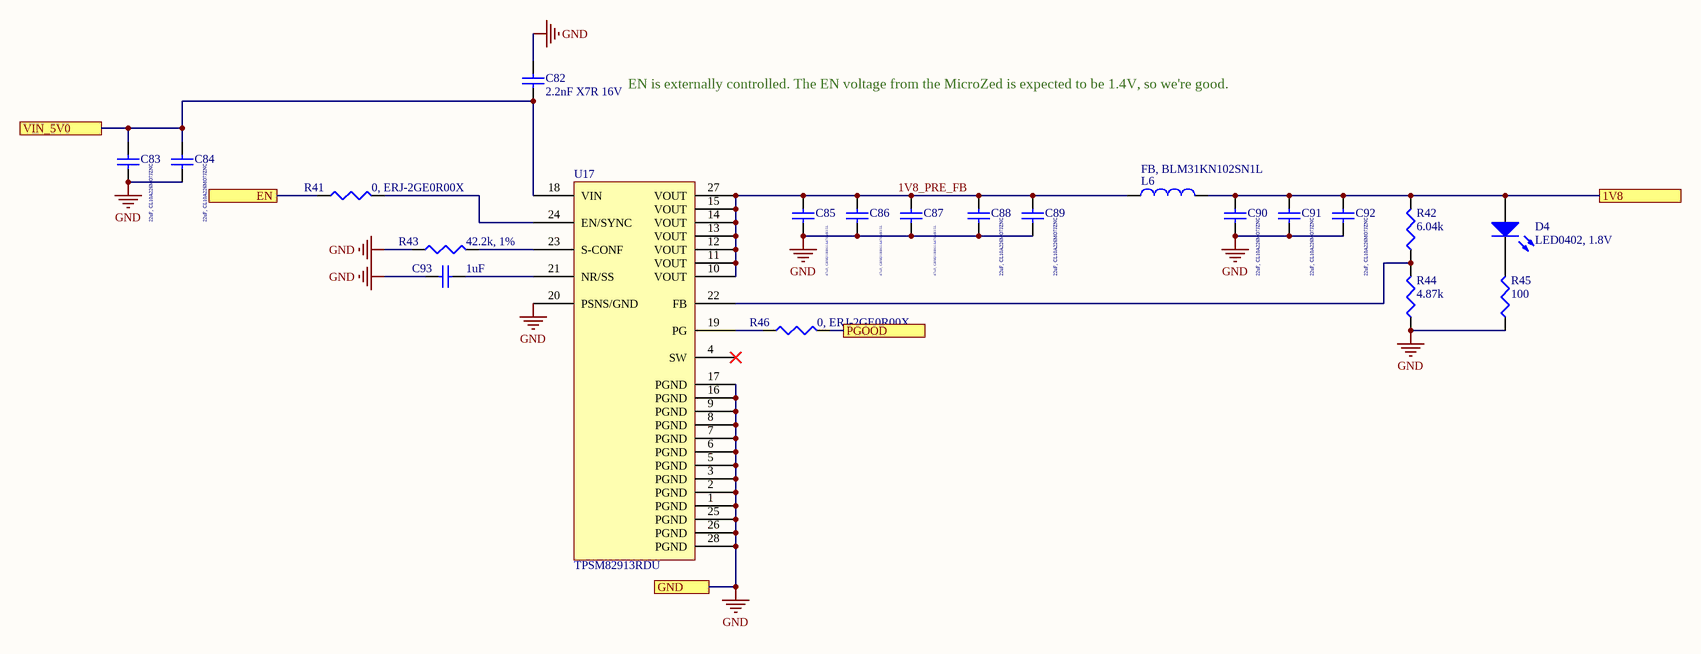
[diagram p10: Buck_TPSM82913_1V8.SchDoc]

### Parts
C82  2.2nF X7R 16V  [SMD-0402]
C83  22uF, CL10A226MO7JZNC  [SMD-0603]
C84  22uF, CL10A226MO7JZNC  [SMD-0603]
C85  47uF, GRM21BR61A476ME15L  [SMD-0805]
C86  47uF, GRM21BR61A476ME15L  [SMD-0805]
C87  47uF, GRM21BR61A476ME15L  [SMD-0805]
C88  22uF, CL10A226MO7JZNC  [SMD-0603]
C89  22uF, CL10A226MO7JZNC  [SMD-0603]
C90  22uF, CL10A226MO7JZNC  [SMD-0603]
C91  22uF, CL10A226MO7JZNC  [SMD-0603]
C92  22uF, CL10A226MO7JZNC  [SMD-0603]
C93  1uF  [SMD-0402]
D4  LED0402, 1.8V  [LED-0402]
L6  FB, BLM31KN102SN1L  [SMD-1206]
R41  0, ERJ-2GE0R00X  [SMD-0402]
R42  6.04k  [SMD-0402]
R43  42.2k, 1%  [SMD-0402]
R44  4.87k  [SMD-0402]
R45  100  [SMD-0402]
R46  0, ERJ-2GE0R00X  [SMD-0402]
U17  TPSM82913RDU  [TPSM82913DRUR]

### Ports
1V8 (see Microzed_Interfaces[3B]), EN (see Microzed_Interfaces[3B]), GND (see Microzed_Interfaces[3B], 3V7_to_3V3_LDO[1B], 5V5_to_5V0_LDO[1C], Buck_TPSM82913_3V7[3C], Buck_TPSM82913_5V0[3C], Buck_TPSM82913_5V5[2C], Clocking_and_LO[2A], Fan_Interfaces[2B], IQ_Demod[1C], IQ_Mod[1B], LMX2820[4D], Microzed_Interfaces[1A], Power_Supply[6B], Voltage_Conv_Bidirectional[1B]), PGOOD (see Microzed_Interfaces[3B]), VIN_5V0 (see Microzed_Interfaces[3B])

### Nets
1V8: C90.2 C91.2 C92.2 D4.1(A) L6.2 R42.2 ; port 1V8
5V0_Zynq: C82.1 C83.2 C84.2 U17.18(VIN) ; port VIN_5V0
GND: C82.2 C83.1 C84.1 C85.1 C86.1 C87.1 C88.1 C89.1 C90.1 C91.1 C92.1 C93.1 R43.1 R44.1 R45.1 U17.1(PGND) U17.2(PGND) U17.3(PGND) U17.5(PGND) U17.6(PGND) U17.7(PGND) U17.8(PGND) U17.9(PGND) U17.16(PGND) U17.17(PGND) U17.20(PSNS/GND) U17.25(PGND) U17.26(PGND) U17.28(PGND) ; port GND
1V8_PRE_FB: C85.2 C86.2 C87.2 C88.2 C89.2 L6.1 U17.10(VOUT) U17.11(VOUT) U17.12(VOUT) U17.13(VOUT) U17.14(VOUT) U17.15(VOUT) U17.27(VOUT)
NetC93_2: C93.2 U17.21(NR/SS)
NetD4_2: D4.2(K) R45.2
NetJX2_10: R41.1 ; port EN
NetJX2_11: R46.2 ; port PGOOD
NetR41_2: R41.2 U17.24(EN/SYNC)
NetR42_1: R42.1 R44.2 U17.22(FB)
NetR43_2: R43.2 U17.23(S-CONF)
NetR46_1: R46.1 U17.19(PG)

Not connected (* = marked no-connect by the designer): U17 4(SW)*

### Notes on the sheet
- EN is externally controlled. The EN voltage from the MicroZed is expected to be 1.4V, so we're good.

### Library data of the parts
C82 C93 = CAP0402: Ceramic Capacitor 0402
C83 C84 C88-C92 = CAP0603: Ceramic Capacitor 0603
C85-C87 = CAP0805: as C100 on sheet Power_Supply
D4 = LED0402: LED 0402
L6 = L1206: Inductor 1206
R41-R46 = RES0402: Resistor-0402